# EAGLE schematic CFT-PB1-revB (EAGLE 5.11)
DRAWN_BY: Alexios; PROJECT_NAME: CFT Mini-Computer; REVISION: Rev K; SHEET_DESCRIPTION: Bus Connectors; SIMULATION_FILENAME: N/A; URL: http://www.bedroomlan.org/cft

## Sheet 1 of 11
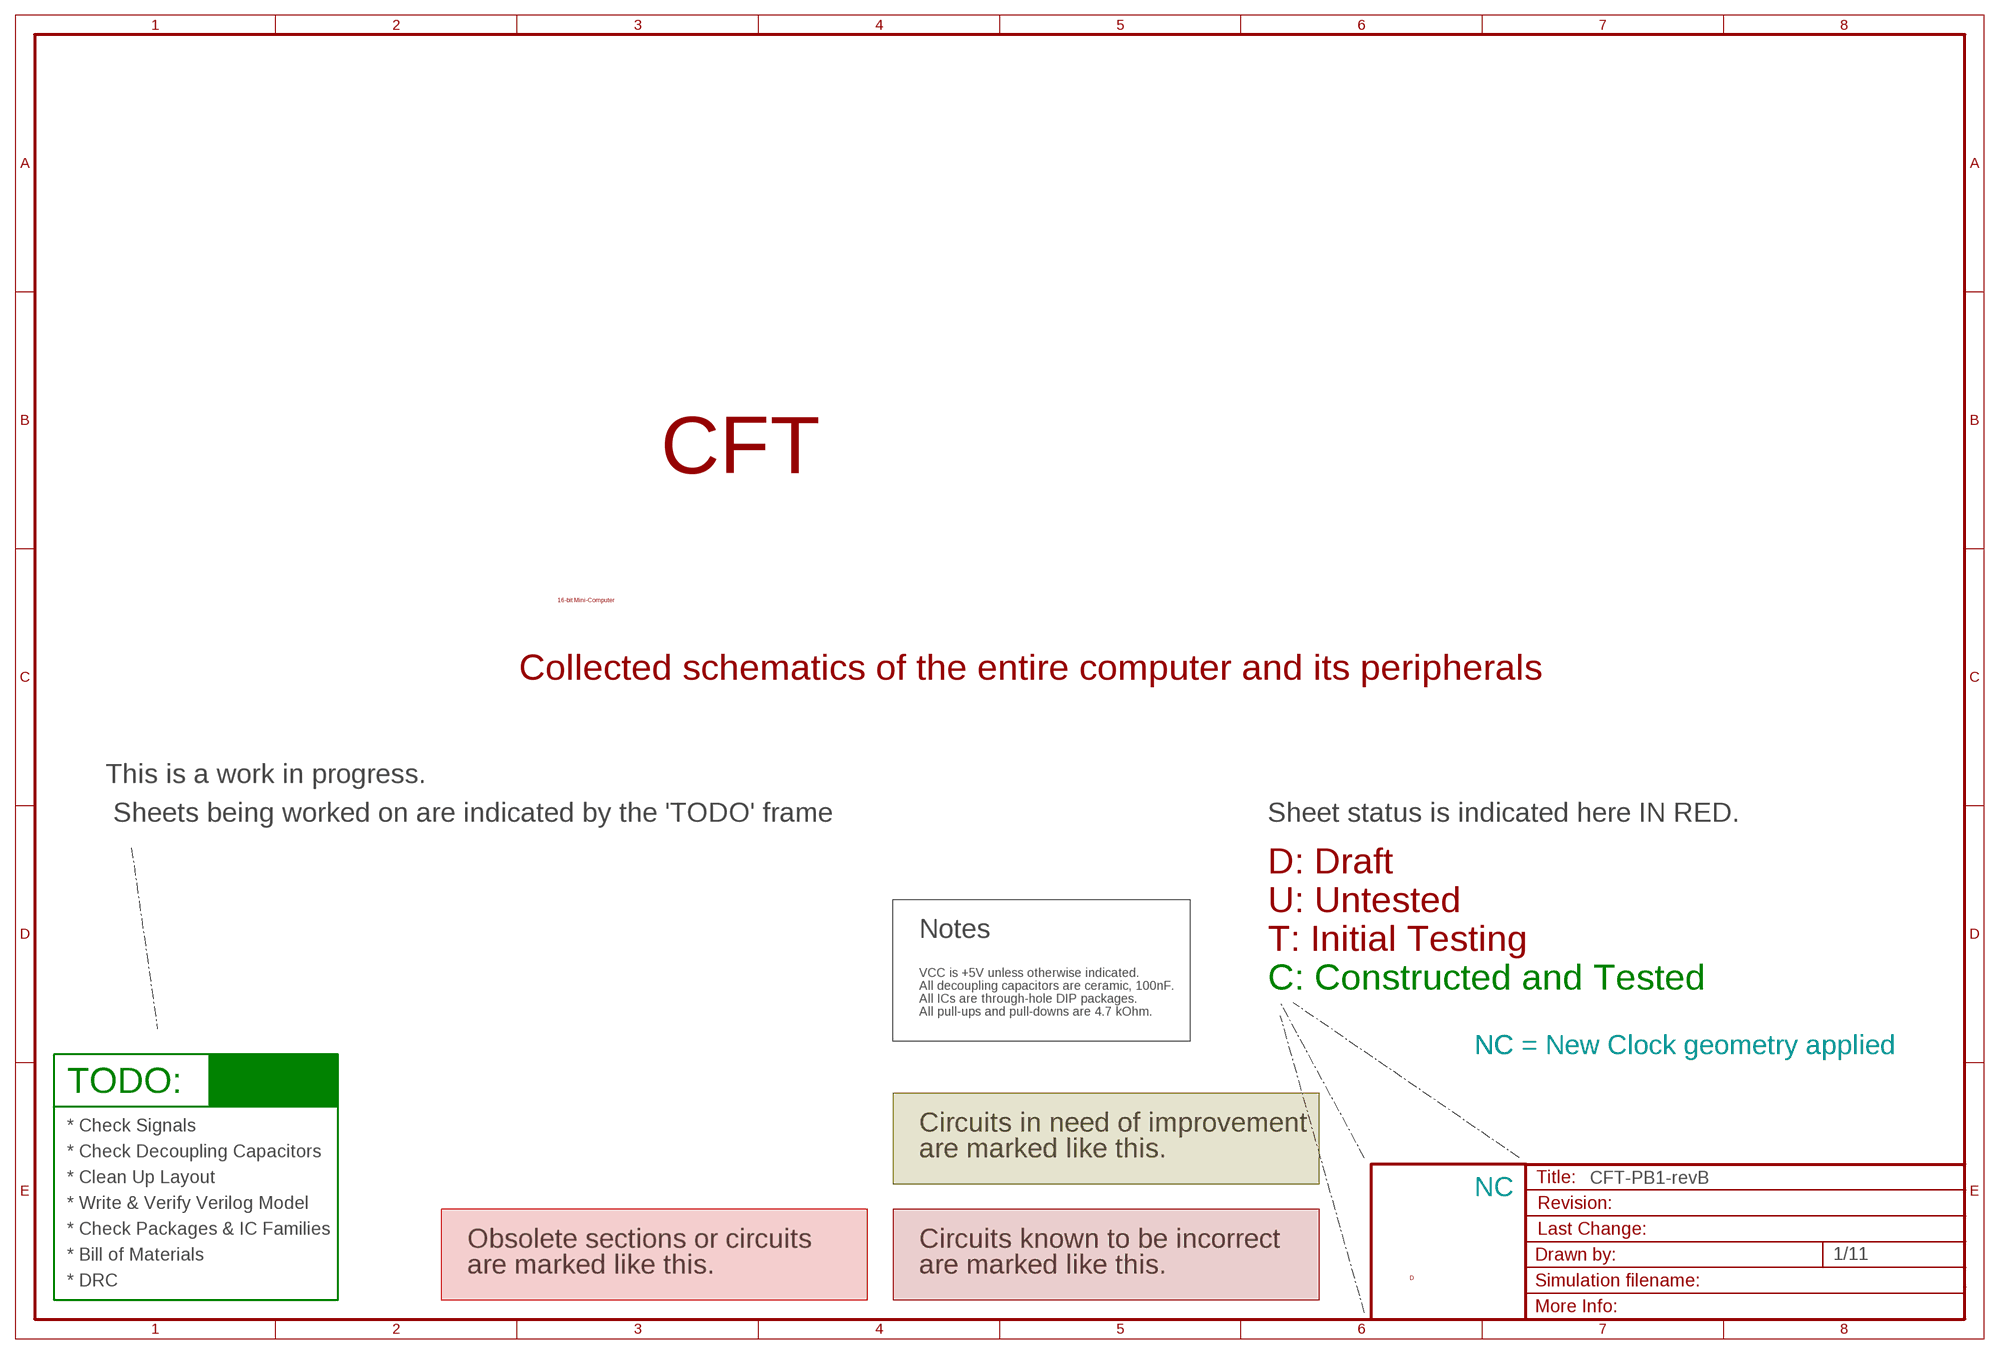
[diagram p0: schematic, sheet 1]

### Notes on the sheet
- CFT
- 16-bit Mini-Computer
- Collected schematics of the entire computer and its peripherals
- This is a work in progress.
- Sheets being worked on are indicated by the 'TODO' frame | Sheet status is indicated here IN RED.
- D: Draft
- U: Untested
- Notes
- T: Initial Testing
- VCC is +5V unless otherwise indicated.
- All decoupling capacitors are ceramic, 100nF. | C: Constructed and Tested
- All ICs are through-hole DIP packages.
- All pull-ups and pull-downs are 4.7 kOhm.
- NC | NC = New Clock geometry applied
- TODO:
- * Check Signals | Circuits in need of improvement
- * Check Decoupling Capacitors | are marked like this.
- * Clean Up Layout
- NC
- * Write & Verify Verilog Model
- * Check Packages & IC Families
- Obsolete sections or circuits | Circuits known to be incorrect
- * Bill of Materials
- are marked like this. | are marked like this.
- D
- * DRC

## Sheet 2 of 11
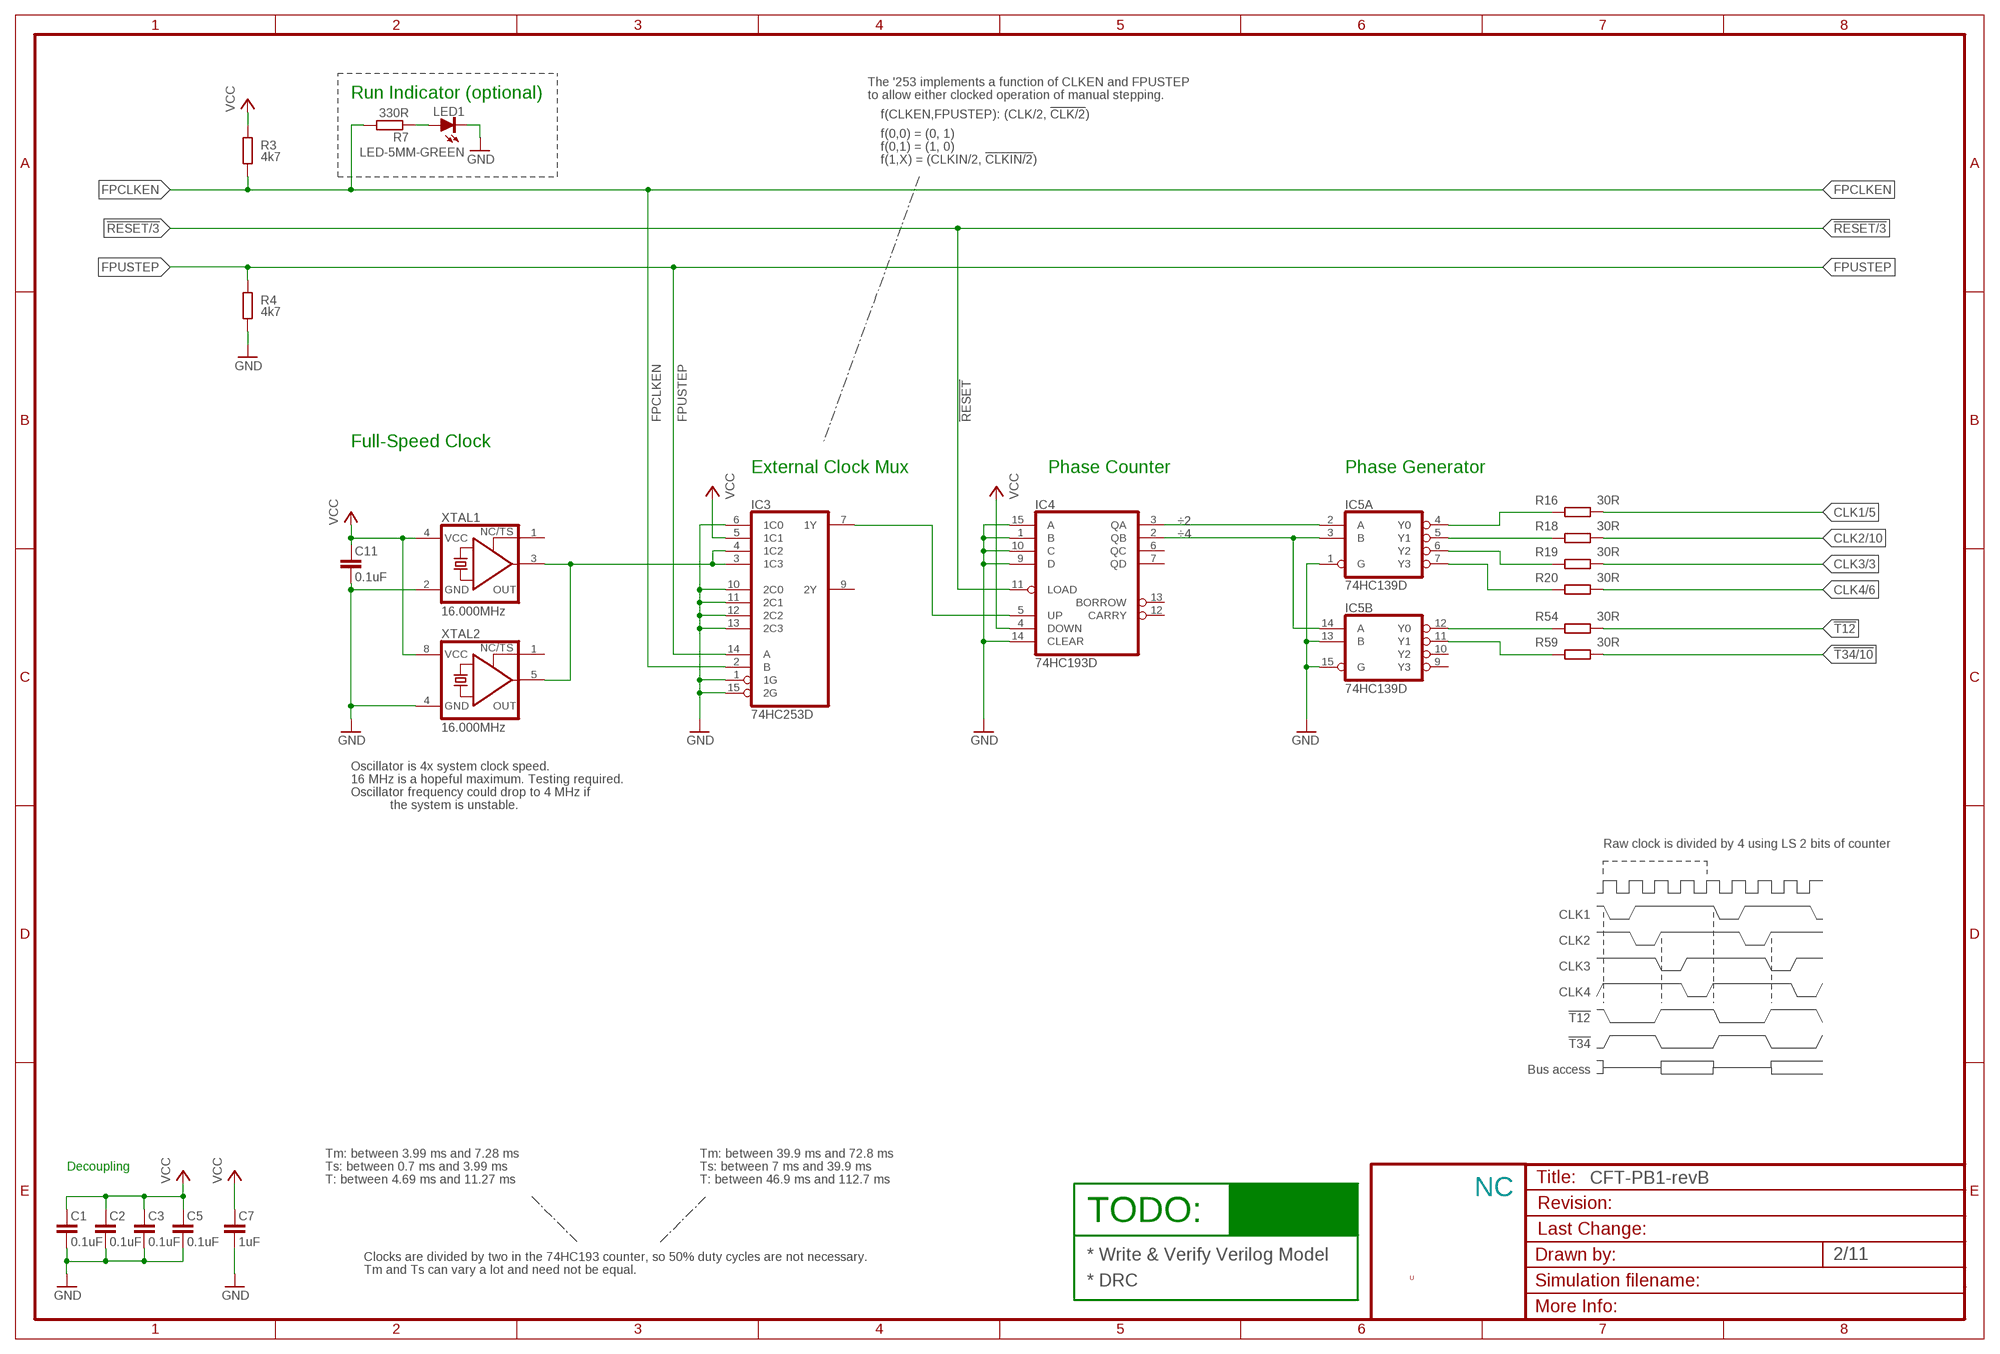
[diagram p1: schematic, sheet 2]

### Parts
C1  0.1uF  C-EUC0805K  [C0805K]
C2  0.1uF  C-EUC0805K  [C0805K]
C3  0.1uF  C-EUC0805K  [C0805K]
C5  0.1uF  C-EUC0805K  [C0805K]
C7  1uF  C-EUC1206K  [C1206K]
C11  0.1uF  C-EUC0805K  [C0805K]
IC3  74HC253D  [SO16]
IC4  74HC193D  [SO16D]
IC5  74HC139D  [SO16]
LED1  LED-5MM-GREEN  LEDCHIPLED_0805  [CHIPLED_0805]
R3  4k7  R-EU_R0805  [R0805]
R4  4k7  R-EU_R0805  [R0805]
R7  330R  R-EU_R0805  [R0805]
R16  30R  R-EU_R0805  [R0805]
R18  30R  R-EU_R0805  [R0805]
R19  30R  R-EU_R0805  [R0805]
R20  30R  R-EU_R0805  [R0805]
R54  30R  R-EU_R0805  [R0805]
R59  30R  R-EU_R0805  [R0805]
XTAL1  16.000MHz  XO-SMD-5X3.2  [CRYSTAL-SMD-5X3.2MM]
XTAL2  16.000MHz  XO-08-SOCKET  [DIL08S-SOCKET]

### Nets
!RESET: IC4.11(LOAD) ; also sheet 3,5,6,8,9,10,11
!T12: R54.1
!T34: R59.1 ; also sheet 10,11
CLK1: R16.1 ; also sheet 5,11
CLK2: R18.1 ; also sheet 10,11
CLK3: R19.1 ; also sheet 3,5,11
CLK4: R20.1 ; also sheet 6,10,11
FASTCLK: IC3.3(1C3) IC3.4(1C2) XTAL1.3(OUT) XTAL2.5(OUT)
FPCLKEN: IC3.2(B) R3.1 R7.2 ; also sheet 11
FPUSTEP: IC3.14(A) R4.2 ; also sheet 11
GND [low power]: C1.1 C2.1 C3.1 C5.1 C7.1 C11.1 IC3.1(1G) IC3.6(1C0) IC3.10(2C0) IC3.11(2C1) IC3.12(2C2) IC3.13(2C3) IC3.15(2G) IC4.1(B) IC4.9(D) IC4.10(C) IC4.14(CLEAR) IC4.15(A) IC5.1(A:G) IC5.13(B:B) IC5.15(B:G) LED1.C R4.1 XTAL1.2(GND) XTAL2.4(GND) ; also sheet 3,4,5,6,7,8,9,10,11
N$3: IC5.4(A:Y0) R16.2
N$4: IC5.5(A:Y1) R18.2
N$6: IC5.6(A:Y2) R19.2
N$7: IC5.7(A:Y3) R20.2
N$8: IC5.12(B:Y0) R54.2
N$9: IC5.11(B:Y1) R59.2
N$347: LED1.A R7.1
N$418: IC3.7(1Y) IC4.5(UP)
VCC [low power]: C1.2 C2.2 C3.2 C5.2 C7.2 C11.2 IC3.5(1C1) IC4.4(DOWN) R3.2 XTAL1.4(VCC) XTAL2.8(VCC) ; also sheet 3,4,5,6,7,8,9,10,11
÷2: IC4.3(QA) IC5.2(A:A)
÷4: IC4.2(QB) IC5.3(A:B) IC5.14(B:A)
Unconnected: IC3.9(2Y) IC4.6(QC) IC4.7(QD) IC4.12(CARRY) IC4.13(BORROW) IC5.9(B:Y3) IC5.10(B:Y2) XTAL1.1(TS) XTAL2.1(TS)

### Notes on the sheet
- The '253 implements a function of CLKEN and FPUSTEP
- Run Indicator (optional) | to allow either clocked operation of manual stepping.
- f(CLKEN,FPUSTEP): (CLK/2, !CLK/2!)
- f(0,0) = (0, 1)
- f(0,1) = (1, 0)
- f(1,X) = (CLKIN/2, !CLKIN/2!)
- Full-Speed Clock
- External Clock Mux | Phase Counter | Phase Generator
- Oscillator is 4x system clock speed.
- 16 MHz is a hopeful maximum. Testing required.
- Oscillator frequency could drop to 4 MHz if
- the system is unstable.
- Raw clock is divided by 4 using LS 2 bits of counter
- CLK1
- CLK2
- CLK3
- CLK4
- !T12
- !T34
- Bus access
- Tm: between 3.99 ms and 7.28 ms | Tm: between 39.9 ms and 72.8 ms
- Decoupling | Ts: between 0.7 ms and 3.99 ms | Ts: between 7 ms and 39.9 ms
- T: between 4.69 ms and 11.27 ms | T: between 46.9 ms and 112.7 ms
- NC
- TODO:
- Clocks are divided by two in the 74HC193 counter, so 50% duty cycles are not necessary. | * Write & Verify Verilog Model
- Tm and Ts can vary a lot and need not be equal.
- U
- * DRC

## Sheet 3 of 11
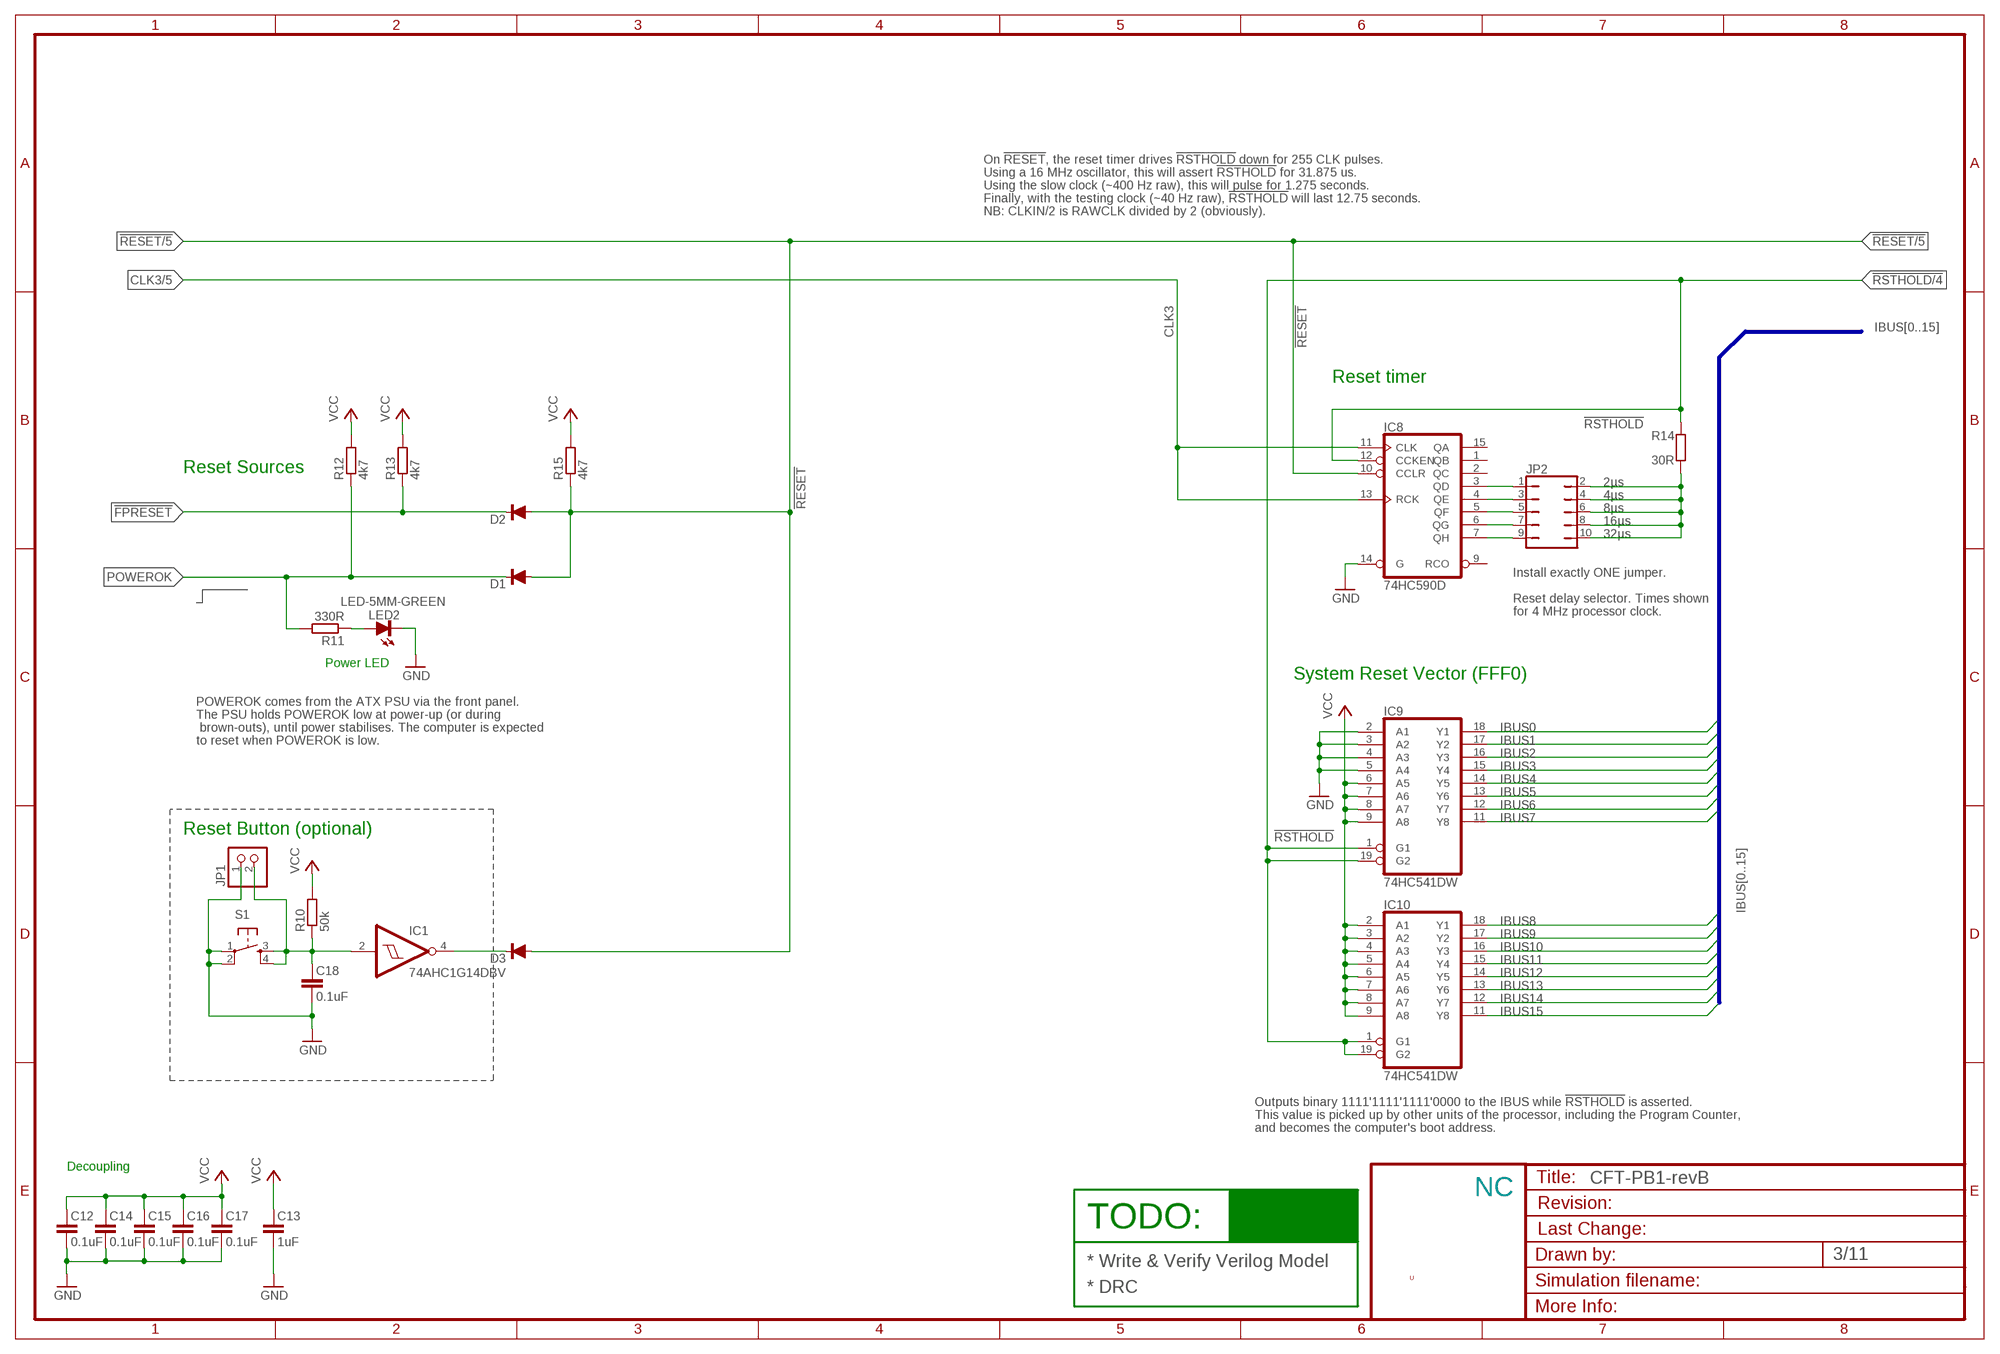
[diagram p2: schematic, sheet 3]

### Parts
C12  0.1uF  C-EUC0805K  [C0805K]
C13  1uF  C-EUC1206K  [C1206K]
C14  0.1uF  C-EUC0805K  [C0805K]
C15  0.1uF  C-EUC0805K  [C0805K]
C16  0.1uF  C-EUC0805K  [C0805K]
C17  0.1uF  C-EUC0805K  [C0805K]
C18  0.1uF  C-EUC0805K  [C0805K]
D1  DIODE-SOD123  [SOD123]
D2  DIODE-SOD123  [SOD123]
D3  DIODE-SOD123  [SOD123]
IC1  74AHC1G14DBV  [SOT23-5]
IC8  74HC590D  [SO16]
IC9  74HC541DW  [SO20W]
IC10  74HC541DW  [SO20W]
JP1  PINHD-1X2  [1X02]
JP2  JP5Q  [JP5Q]
LED2  LED-5MM-GREEN  LEDCHIPLED_0805  [CHIPLED_0805]
R10  50k  R-EU_R0805  [R0805]
R11  330R  R-EU_R0805  [R0805]
R12  4k7  R-EU_R0805  [R0805]
R13  4k7  R-EU_R0805  [R0805]
R14  30R  R-EU_R0805  [R0805]
R15  4k7  R-EU_R0805  [R0805]
S1  TAC_SWITCHPTH  [TACTILE-PTH]

### Nets
!FPRESET: D2.C R13.1 ; also sheet 11
!RESET: D1.A D2.A D3.A IC8.10(CCLR) R15.1 ; also sheet 2,5,6,8,9,10,11
!RSTHOLD: IC8.12(CCKEN) IC9.1(G1) IC9.19(G2) IC10.1(G1) IC10.19(G2) R14.1 ; also sheet 4,11
CLK3: IC8.11(CLK) IC8.13(RCK) ; also sheet 2,5,11
GND [low power]: C12.1 C13.1 C14.1 C15.1 C16.1 C17.1 C18.1 IC8.14(G) IC9.2(A1) IC9.3(A2) IC9.4(A3) IC9.5(A4) JP1.1 LED2.C S1.1 S1.2 ; also sheet 2,4,5,6,7,8,9,10,11
IBUS0: IC9.18(Y1) ; also sheet 7,8,10,11
IBUS1: IC9.17(Y2) ; also sheet 7,8,10,11
IBUS2: IC9.16(Y3) ; also sheet 7,8,10,11
IBUS3: IC9.15(Y4) ; also sheet 7,8,10,11
IBUS4: IC9.14(Y5) ; also sheet 7,8,10,11
IBUS5: IC9.13(Y6) ; also sheet 7,8,10,11
IBUS6: IC9.12(Y7) ; also sheet 7,8,10,11
IBUS7: IC9.11(Y8) ; also sheet 7,8,10,11
IBUS8: IC10.18(Y1) ; also sheet 7,8,10,11
IBUS9: IC10.17(Y2) ; also sheet 7,8,10,11
IBUS10: IC10.16(Y3) ; also sheet 7,8,10,11
IBUS11: IC10.15(Y4) ; also sheet 7,8,10,11
IBUS12: IC10.14(Y5) ; also sheet 7,8,10,11
IBUS13: IC10.13(Y6) ; also sheet 7,8,10,11
IBUS14: IC10.12(Y7) ; also sheet 7,8,10,11
IBUS15: IC10.11(Y8) ; also sheet 7,8,10,11
N$2: D3.C IC1.4(O)
N$10: JP2.2 JP2.4 JP2.6 JP2.8 JP2.10 R14.2
N$33: C18.2 IC1.2(I) JP1.2 R10.1 S1.3 S1.4
N$36: IC8.7(QH) JP2.9
N$154: IC8.6(QG) JP2.7
N$375: IC8.5(QF) JP2.5
N$376: IC8.4(QE) JP2.3
N$377: IC8.3(QD) JP2.1
POWERLED: LED2.A R11.1
POWEROK: D1.C R11.2 R12.1 ; also sheet 11
VCC [low power]: C12.2 C13.2 C14.2 C15.2 C16.2 C17.2 IC9.6(A5) IC9.7(A6) IC9.8(A7) IC9.9(A8) IC10.2(A1) IC10.3(A2) IC10.4(A3) IC10.5(A4) IC10.6(A5) IC10.7(A6) IC10.8(A7) IC10.9(A8) R10.2 R12.2 R13.2 R15.2 ; also sheet 2,4,5,6,7,8,9,10,11
Unconnected: IC8.1(QB) IC8.2(QC) IC8.9(RCO) IC8.15(QA)

### Buses
IBUS[0..15]

### Notes on the sheet
- On !RESET!, the reset timer drives !RSTHOLD! down for 255 CLK pulses.
- Using a 16 MHz oscillator, this will assert !RSTHOLD! for 31.875 us.
- Using the slow clock (~400 Hz raw), this will pulse for 1.275 seconds.
- Finally, with the testing clock (~40 Hz raw), !RSTHOLD! will last 12.75 seconds.
- NB: CLKIN/2 is RAWCLK divided by 2 (obviously).
- Reset timer
- Reset Sources
- 2µs
- 4µs
- 8µs
- 16µs
- 32µs
- Install exactly ONE jumper.
- Reset delay selector. Times shown
- for 4 MHz processor clock.
- Power LED
- System Reset Vector (FFF0)
- POWEROK comes from the ATX PSU via the front panel.
- The PSU holds POWEROK low at power-up (or during
- brown-outs), until power stabilises. The computer is expected
- to reset when POWEROK is low.
- Reset Button (optional)
- Outputs binary 1111'1111'1111'0000 to the IBUS while !RSTHOLD! is asserted.
- This value is picked up by other units of the processor, including the Program Counter,
- and becomes the computer's boot address.
- Decoupling
- NC
- TODO:
- * Write & Verify Verilog Model
- U
- * DRC

## Sheet 4 of 11
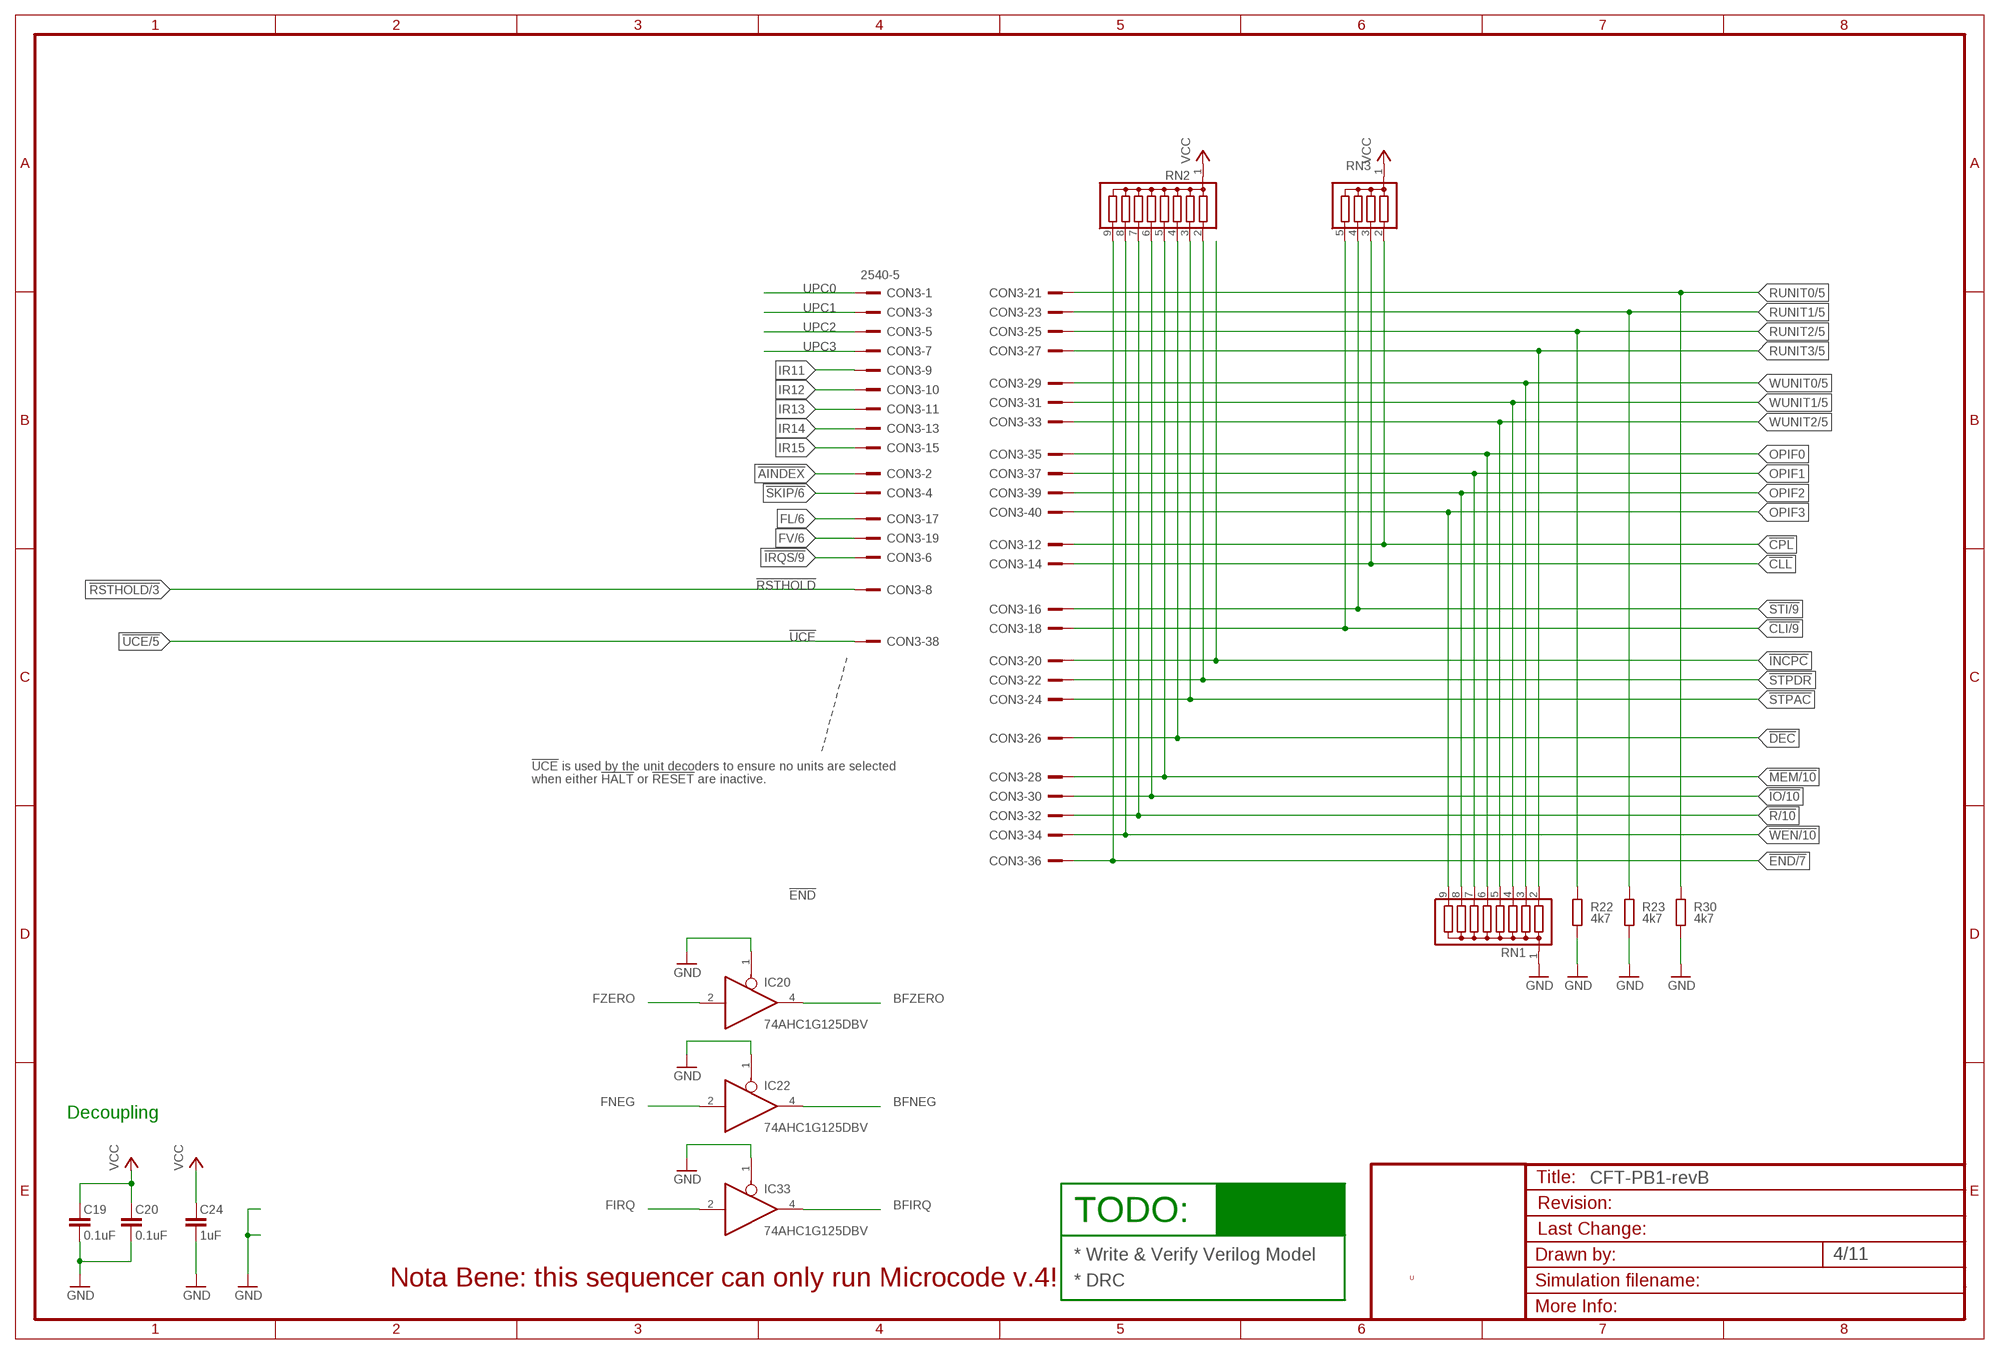
[diagram p3: schematic, sheet 4]

### Parts
C19  0.1uF  C-EUC0805K  [C0805K]
C20  0.1uF  C-EUC0805K  [C0805K]
C24  1uF  C-EUC1206K  [C1206K]
CON3  2540-5  [PAK100/2500-5-40]
IC20  74AHC1G125DBV  [SOT23-5]
IC22  74AHC1G125DBV  [SOT23-5]
IC33  74AHC1G125DBV  [SOT23-5]
R22  4k7  R-EU_R0805  [R0805]
R23  4k7  R-EU_R0805  [R0805]
R30  4k7  R-EU_R0805  [R0805]
RN1  G08R  [SIL9]
RN2  G08R  [SIL9]
RN3  G04R  [SIL5]

### Nets
!AINDEX: CON3.2
!CLI: CON3.18 RN3.5 ; also sheet 9
!CLL: CON3.14 RN3.3 ; also sheet 11
!CPL: CON3.12 RN3.2 ; also sheet 11
!DEC: CON3.26 RN2.4
!END: CON3.36 RN2.9 ; also sheet 7,9
!INCPC: CON3.20 ; also sheet 11
!IO: CON3.30 RN2.6 ; also sheet 10,11
!IRQS: CON3.6 ; also sheet 9,11
!MEM: CON3.28 RN2.5 ; also sheet 10,11
!R: CON3.32 RN2.7 ; also sheet 10,11
!RSTHOLD: CON3.8 ; also sheet 3,11
!SKIP: CON3.4 ; also sheet 6
!STI: CON3.16 RN3.4 ; also sheet 9
!STPAC: CON3.24 RN2.3 ; also sheet 11
!STPDR: CON3.22 RN2.2 ; also sheet 11
!UCE: CON3.38 ; also sheet 5
!WEN: CON3.34 RN2.8 ; also sheet 10,11
BFIRQ: IC33.4(O) ; also sheet 11
BFNEG: IC22.4(O) ; also sheet 11
BFZERO: IC20.4(O) ; also sheet 11
FIRQ: IC33.2(I) ; also sheet 9
FL: CON3.17 ; also sheet 6,11
FNEG: IC22.2(I) ; also sheet 6,11
FV: CON3.19 ; also sheet 6,11
FZERO: IC20.2(I) ; also sheet 6,11
GND [low power]: C20.1 C24.1 IC20.1(OE) IC22.1(OE) IC33.1(OE) R22.1 R23.1 R30.1 RN1.1 ; also sheet 2,3,5,6,7,8,9,10,11
IR11: CON3.9 ; also sheet 8
IR12: CON3.10 ; also sheet 8
IR13: CON3.11 ; also sheet 8
IR14: CON3.13 ; also sheet 8
IR15: CON3.15 ; also sheet 8
OPIF0: CON3.35 RN1.6 ; also sheet 6
OPIF1: CON3.37 RN1.7 ; also sheet 6
OPIF2: CON3.39 RN1.8 ; also sheet 6
OPIF3: CON3.40 RN1.9 ; also sheet 6
RUNIT0: CON3.21 R30.2 ; also sheet 5,11
RUNIT1: CON3.23 R23.2 ; also sheet 5,11
RUNIT2: CON3.25 R22.2 ; also sheet 5,11
RUNIT3: CON3.27 RN1.2 ; also sheet 5,11
UPC0: CON3.1 ; also sheet 8
UPC1: CON3.3 ; also sheet 8
UPC2: CON3.5 ; also sheet 8
UPC3: CON3.7 ; also sheet 8
VCC [low power]: C20.2 C24.2 RN2.1 RN3.1 ; also sheet 2,3,5,6,7,8,9,10,11
WUNIT0: CON3.29 RN1.3 ; also sheet 5
WUNIT1: CON3.31 RN1.4 ; also sheet 5
WUNIT2: CON3.33 RN1.5 ; also sheet 5
Unconnected: C19.1 C19.2

### Notes on the sheet
- !UCE! is used by the unit decoders to ensure no units are selected
- when either !HALT! or !RESET! are inactive.
- Decoupling
- TODO:
- * Write & Verify Verilog Model
- U
- Nota Bene: this sequencer can only run Microcode v.4! | * DRC

## Sheet 5 of 11
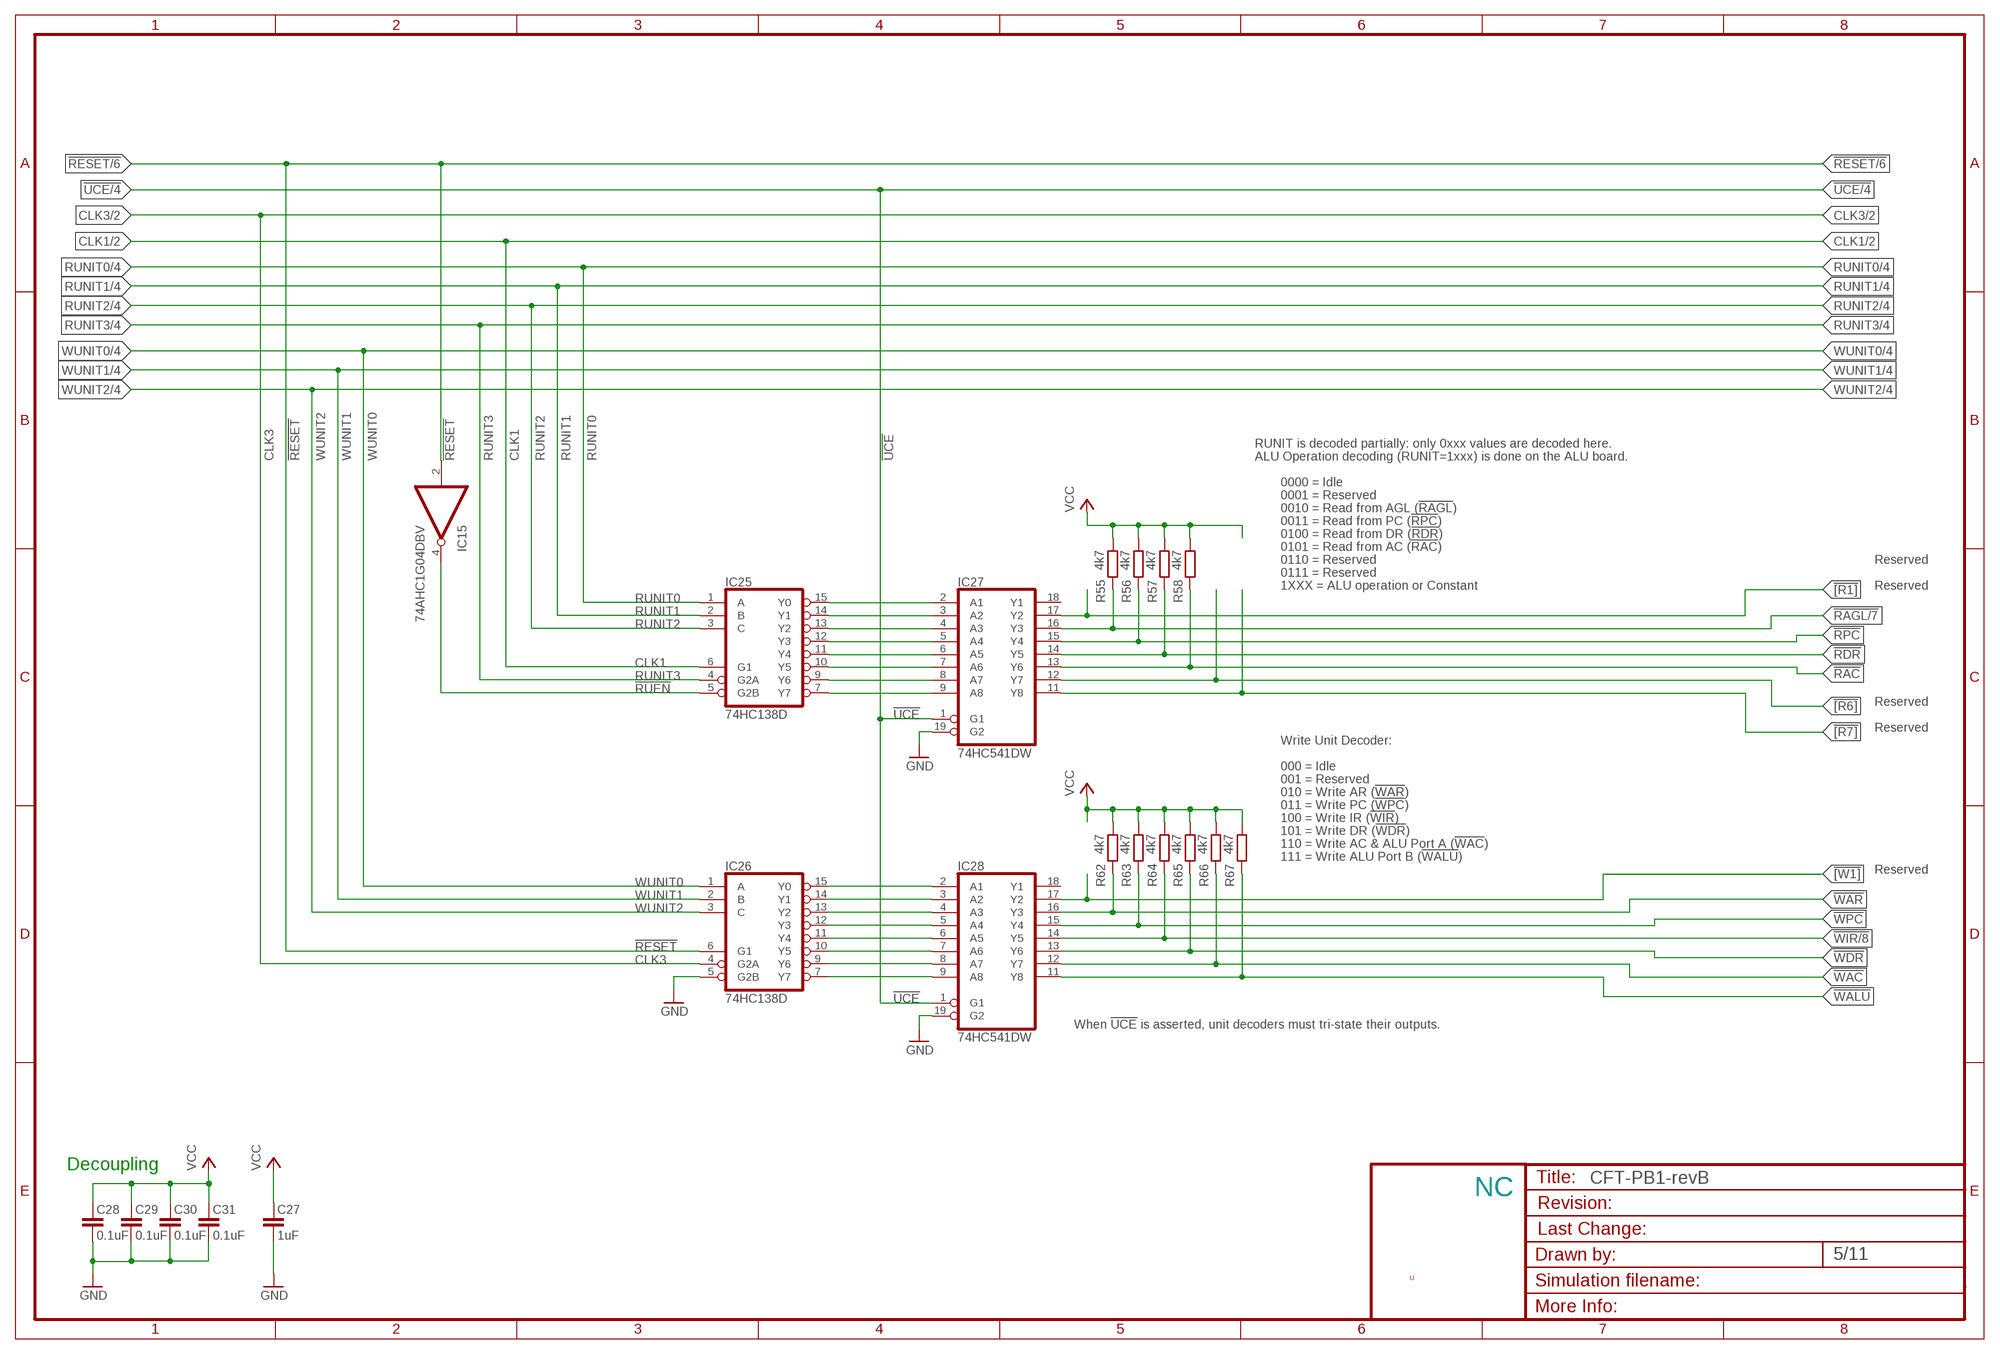
[diagram p4: schematic, sheet 5]

### Parts
C27  1uF  C-EUC1206K  [C1206K]
C28  0.1uF  C-EUC0805K  [C0805K]
C29  0.1uF  C-EUC0805K  [C0805K]
C30  0.1uF  C-EUC0805K  [C0805K]
C31  0.1uF  C-EUC0805K  [C0805K]
IC15  74AHC1G04DBV  [SOT23-5]
IC25  74HC138D  [SO16]
IC26  74HC138D  [SO16]
IC27  74HC541DW  [SO20W]
IC28  74HC541DW  [SO20W]
R55  4k7  R-EU_R0805  [R0805]
R56  4k7  R-EU_R0805  [R0805]
R57  4k7  R-EU_R0805  [R0805]
R58  4k7  R-EU_R0805  [R0805]
R62  4k7  R-EU_R0805  [R0805]
R63  4k7  R-EU_R0805  [R0805]
R64  4k7  R-EU_R0805  [R0805]
R65  4k7  R-EU_R0805  [R0805]
R66  4k7  R-EU_R0805  [R0805]
R67  4k7  R-EU_R0805  [R0805]

### Nets
![R1]: IC27.17(Y2)
![R6]: IC27.12(Y7)
![R7]: IC27.11(Y8)
![W1]: IC28.17(Y2)
!RAC: IC27.13(Y6) R58.1 ; also sheet 11
!RAGL: IC27.16(Y3) R55.1 ; also sheet 7
!RDR: IC27.14(Y5) R57.1 ; also sheet 11
!RESET: IC15.2(I) IC26.6(G1) ; also sheet 2,3,6,8,9,10,11
!RPC: IC27.15(Y4) R56.1 ; also sheet 11
!RUEN: IC15.4(O) IC25.5(G2B)
!UCE: IC27.1(G1) IC28.1(G1) ; also sheet 4
!WAC: IC28.12(Y7) R66.1 ; also sheet 11
!WALU: IC28.11(Y8) R67.1 ; also sheet 11
!WAR: IC28.16(Y3) R62.1 ; also sheet 11
!WDR: IC28.13(Y6) R65.1 ; also sheet 11
!WIR: IC28.14(Y5) R64.1 ; also sheet 8,11
!WPC: IC28.15(Y4) R63.1 ; also sheet 11
CLK1: IC25.6(G1) ; also sheet 2,11
CLK3: IC26.4(G2A) ; also sheet 2,3,11
GND [low power]: C27.1 C28.1 C29.1 C30.1 C31.1 IC26.5(G2B) IC27.19(G2) IC28.19(G2) ; also sheet 2,3,4,6,7,8,9,10,11
N$458: IC25.7(Y7) IC27.9(A8)
N$459: IC25.9(Y6) IC27.8(A7)
N$460: IC25.10(Y5) IC27.7(A6)
N$461: IC25.11(Y4) IC27.6(A5)
N$463: IC25.12(Y3) IC27.5(A4)
N$464: IC25.13(Y2) IC27.4(A3)
N$465: IC25.14(Y1) IC27.3(A2)
N$466: IC25.15(Y0) IC27.2(A1)
N$483: IC26.15(Y0) IC28.2(A1)
N$484: IC26.14(Y1) IC28.3(A2)
N$485: IC26.13(Y2) IC28.4(A3)
N$486: IC26.12(Y3) IC28.5(A4)
N$487: IC26.11(Y4) IC28.6(A5)
N$488: IC26.10(Y5) IC28.7(A6)
N$505: IC26.9(Y6) IC28.8(A7)
N$506: IC26.7(Y7) IC28.9(A8)
RUNIT0: IC25.1(A) ; also sheet 4,11
RUNIT1: IC25.2(B) ; also sheet 4,11
RUNIT2: IC25.3(C) ; also sheet 4,11
RUNIT3: IC25.4(G2A) ; also sheet 4,11
VCC [low power]: C27.2 C28.2 C29.2 C30.2 C31.2 R55.2 R56.2 R57.2 R58.2 R62.2 R63.2 R64.2 R65.2 R66.2 R67.2 ; also sheet 2,3,4,6,7,8,9,10,11
WUNIT0: IC26.1(A) ; also sheet 4
WUNIT1: IC26.2(B) ; also sheet 4
WUNIT2: IC26.3(C) ; also sheet 4
Unconnected: IC27.18(Y1) IC28.18(Y1)

### Notes on the sheet
- RUNIT is decoded partially: only 0xxx values are decoded here.
- ALU Operation decoding (RUNIT=1xxx) is done on the ALU board.
- 0000 = Idle
- 0001 = Reserved
- 0010 = Read from AGL (!RAGL!)
- 0011 = Read from PC (!RPC!)
- 0100 = Read from DR (!RDR!)
- 0101 = Read from AC (!RAC!)
- 0110 = Reserved | Reserved
- 0111 = Reserved
- 1XXX = ALU operation or Constant | Reserved
- Reserved
- Reserved
- Write Unit Decoder:
- 000 = Idle
- 001 = Reserved
- 010 = Write AR (!WAR!)
- 011 = Write PC (!WPC!)
- 100 = Write IR (!WIR!)
- 101 = Write DR (!WDR!)
- 110 = Write AC & ALU Port A (!WAC!)
- 111 = Write ALU Port B (!WALU!)
- Reserved
- When !UCE! is asserted, unit decoders must tri-state their outputs.
- Decoupling
- NC
- U

## Sheet 6 of 11
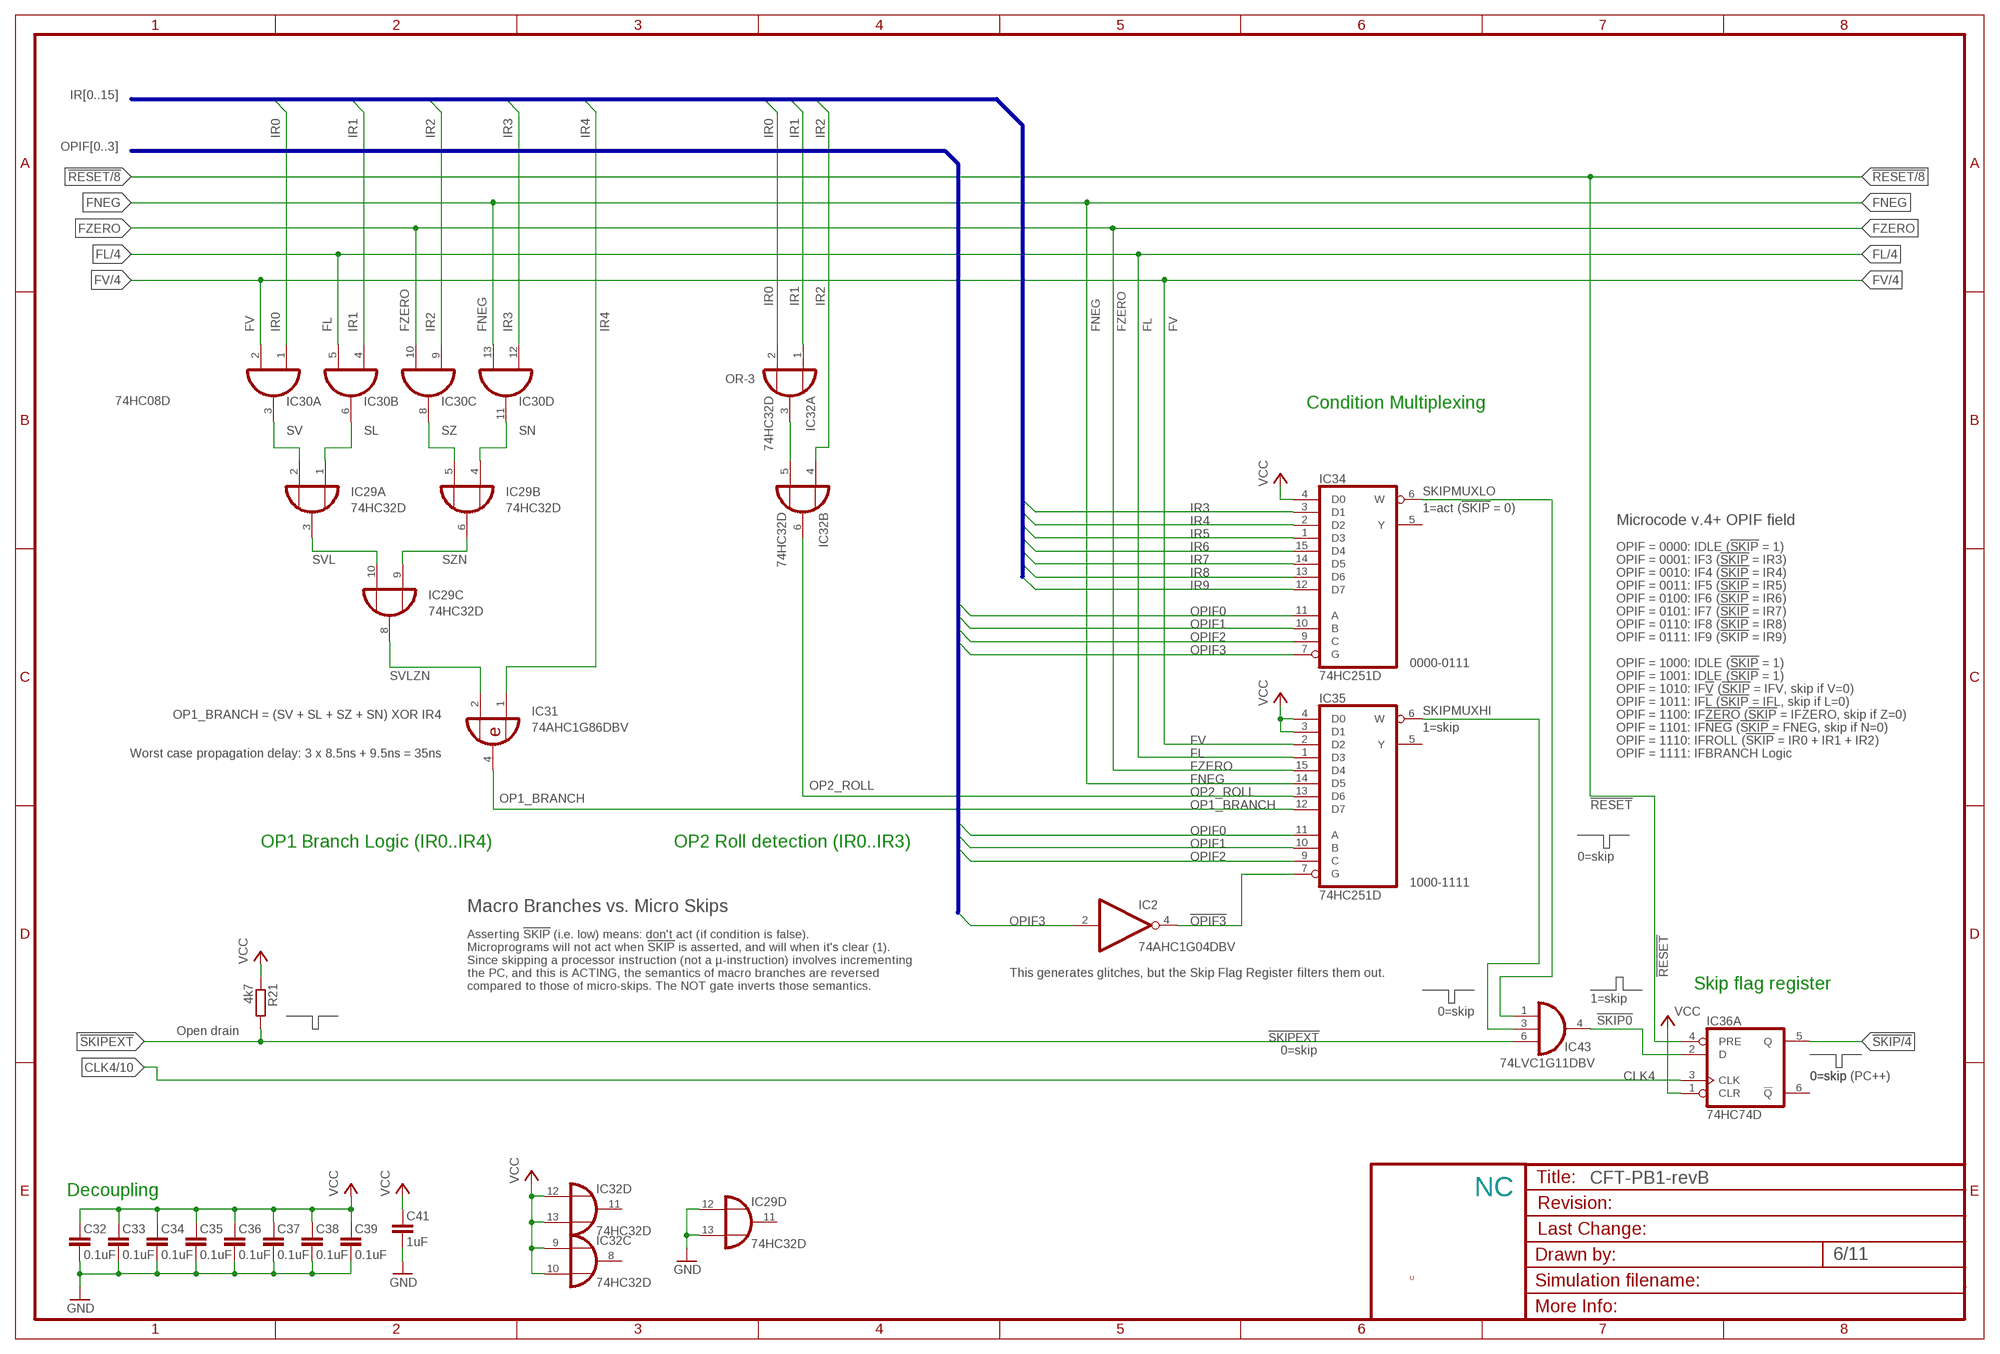
[diagram p5: schematic, sheet 6]

### Parts
C32  0.1uF  C-EUC0805K  [C0805K]
C33  0.1uF  C-EUC0805K  [C0805K]
C34  0.1uF  C-EUC0805K  [C0805K]
C35  0.1uF  C-EUC0805K  [C0805K]
C36  0.1uF  C-EUC0805K  [C0805K]
C37  0.1uF  C-EUC0805K  [C0805K]
C38  0.1uF  C-EUC0805K  [C0805K]
C39  0.1uF  C-EUC0805K  [C0805K]
C41  1uF  C-EUC1206K  [C1206K]
IC2  74AHC1G04DBV  [SOT23-5]
IC29  74HC32D  [SO14]
IC30  74HC08D  [SO14]
IC31  74AHC1G86DBV  [SOT23-5]
IC32  74HC32D  [SO14]
IC34  74HC251D  [SO16]
IC35  74HC251D  [SO16]
IC36  74HC74D  [SO14]
IC43  74LVC1G11DBV  [DBV_R-PDSO-G6]
R21  4k7  R-EU_R0805  [R0805]

### Nets
!OPIF3: IC2.4(O) IC35.7(G)
!RESET: IC36.4(A:PRE) ; also sheet 2,3,5,8,9,10,11
!SKIP: IC36.5(A:Q) ; also sheet 4
!SKIP0: IC36.2(A:D) IC43.4(O)
!SKIPEXT: IC43.6(I2) R21.2 ; also sheet 11
CLK4: IC36.3(A:CLK) ; also sheet 2,10,11
FL: IC30.5(B:I1) IC35.1(D3) ; also sheet 4,11
FNEG: IC30.13(D:I1) IC35.14(D5) ; also sheet 4,11
FV: IC30.2(A:I1) IC35.2(D2) ; also sheet 4,11
FZERO: IC30.10(C:I1) IC35.15(D4) ; also sheet 4,11
GND [low power]: C32.1 C33.1 C34.1 C35.1 C36.1 C37.1 C38.1 C39.1 C41.1 IC29.12(D:I0) IC29.13(D:I1) ; also sheet 2,3,4,5,7,8,9,10,11
IR0: IC30.1(A:I0) IC32.2(A:I1) ; also sheet 7,8,11
IR1: IC30.4(B:I0) IC32.1(A:I0) ; also sheet 7,8,11
IR2: IC30.9(C:I0) IC32.4(B:I0) ; also sheet 7,8,11
IR3: IC30.12(D:I0) IC34.3(D1) ; also sheet 7,8,11
IR4: IC31.1(I0) IC34.2(D2) ; also sheet 7,8
IR5: IC34.1(D3) ; also sheet 7,8
IR6: IC34.15(D4) ; also sheet 7,8
IR7: IC34.14(D5) ; also sheet 7,8
IR8: IC34.13(D6) ; also sheet 7,8
IR9: IC34.12(D7) ; also sheet 7,8
N$23: IC32.3(A:O) IC32.5(B:I1)
OP1_BRANCH: IC31.4(O) IC35.12(D7)
OP2_ROLL: IC32.6(B:O) IC35.13(D6)
OPIF0: IC34.11(A) IC35.11(A) ; also sheet 4
OPIF1: IC34.10(B) IC35.10(B) ; also sheet 4
OPIF2: IC34.9(C) IC35.9(C) ; also sheet 4
OPIF3: IC2.2(I) IC34.7(G) ; also sheet 4
SKIPMUXHI: IC35.6(W) IC43.3(I1)
SKIPMUXLO: IC34.6(W) IC43.1(I0)
SL: IC29.1(A:I0) IC30.6(B:O)
SN: IC29.4(B:I0) IC30.11(D:O)
SV: IC29.2(A:I1) IC30.3(A:O)
SVL: IC29.3(A:O) IC29.10(C:I1)
SVLZN: IC29.8(C:O) IC31.2(I1)
SZ: IC29.5(B:I1) IC30.8(C:O)
SZN: IC29.6(B:O) IC29.9(C:I0)
VCC [low power]: C32.2 C33.2 C34.2 C35.2 C36.2 C37.2 C38.2 C39.2 C41.2 IC32.9(C:I0) IC32.10(C:I1) IC32.12(D:I0) IC32.13(D:I1) IC34.4(D0) IC35.3(D1) IC35.4(D0) IC36.1(A:CLR) R21.1 ; also sheet 2,3,4,5,7,8,9,10,11
Unconnected: IC29.11(D:O) IC32.8(C:O) IC32.11(D:O) IC34.5(Y) IC35.5(Y) IC36.6(A:!Q)

### Buses
IR[0..15]
OPIF[0..3]

### Notes on the sheet
- OR-3
- Condition Multiplexing
- 1=act (!SKIP! = 0)
- Microcode v.4+ OPIF field
- OPIF = 0000: IDLE (!SKIP! = 1)
- OPIF = 0001: IF3 (!SKIP! = IR3)
- OPIF = 0010: IF4 (!SKIP! = IR4)
- OPIF = 0011: IF5 (!SKIP! = IR5)
- OPIF = 0100: IF6 (!SKIP! = IR6)
- OPIF = 0101: IF7 (!SKIP! = IR7)
- OPIF = 0110: IF8 (!SKIP! = IR8)
- OPIF = 0111: IF9 (!SKIP! = IR9)
- 0000-0111 | OPIF = 1000: IDLE (!SKIP! = 1)
- OPIF = 1001: IDLE (!SKIP! = 1)
- OPIF = 1010: IF!V! (!SKIP! = IFV, skip if V=0)
- OPIF = 1011: IF!L! (!SKIP! = IFL, skip if L=0)
- OP1_BRANCH = (SV + SL + SZ + SN) XOR IR4 | OPIF = 1100: IF!ZERO! (!SKIP! = IFZERO, skip if Z=0)
- 1=skip | OPIF = 1101: IF!NEG! (!SKIP! = FNEG, skip if N=0)
- OPIF = 1110: IFROLL (!SKIP! = IR0 + IR1 + IR2)
- Worst case propagation delay: 3 x 8.5ns + 9.5ns = 35ns | OPIF = 1111: IFBRANCH Logic
- OP1 Branch Logic (IR0..IR4) | OP2 Roll detection (IR0..IR3)
- 0=skip
- 1000-1111
- Macro Branches vs. Micro Skips
- Asserting !SKIP! (i.e. low) means: don't act (if condition is false).
- Microprograms will not act when !SKIP! is asserted, and will when it's clear (1).
- Since skipping a processor instruction (not a µ-instruction) involves incrementing
- the PC, and this is ACTING, the semantics of macro branches are reversed | This generates glitches, but the Skip Flag Register filters them out.
- compared to those of micro-skips. The NOT gate inverts those semantics. | Skip flag register
- 1=skip
- 0=skip
- Open drain
- 0=skip
- 0=skip | 0=skip (PC++)
- Decoupling | NC
- U

## Sheet 7 of 11
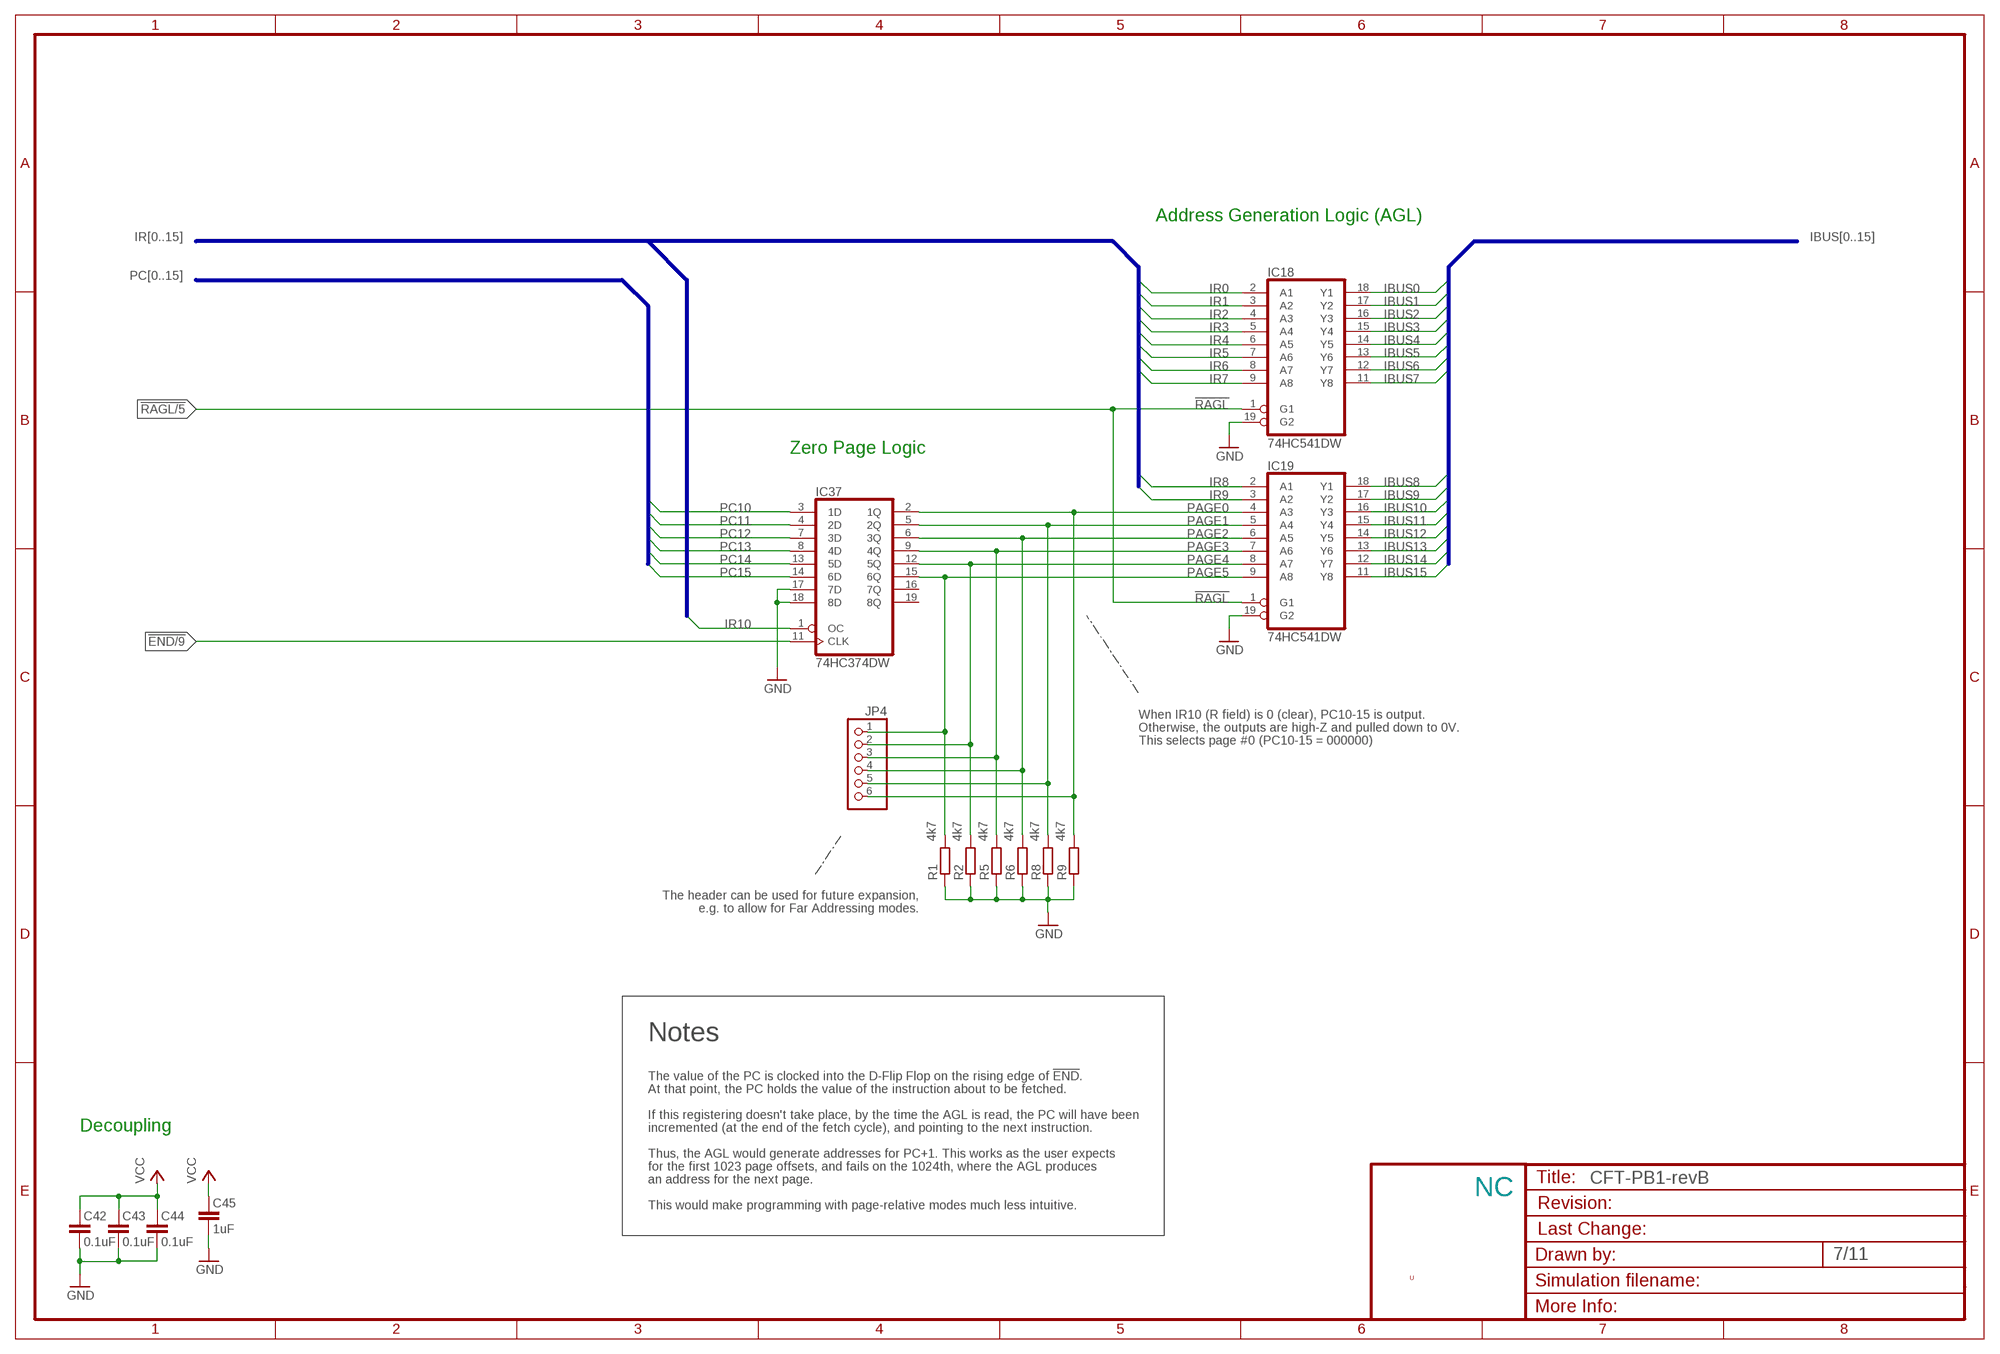
[diagram p6: schematic, sheet 7]

### Parts
C42  0.1uF  C-EUC0805K  [C0805K]
C43  0.1uF  C-EUC0805K  [C0805K]
C44  0.1uF  C-EUC0805K  [C0805K]
C45  1uF  C-EUC1206K  [C1206K]
IC18  74HC541DW  [SO20W]
IC19  74HC541DW  [SO20W]
IC37  74HC374DW  [SO20W]
JP4  PINHD-1X6/90  [1X06/90]
R1  4k7  R-EU_R0805  [R0805]
R2  4k7  R-EU_R0805  [R0805]
R5  4k7  R-EU_R0805  [R0805]
R6  4k7  R-EU_R0805  [R0805]
R8  4k7  R-EU_R0805  [R0805]
R9  4k7  R-EU_R0805  [R0805]

### Nets
!END: IC37.11(CLK) ; also sheet 4,9
!RAGL: IC18.1(G1) IC19.1(G1) ; also sheet 5
GND [low power]: C42.1 C43.1 C44.1 C45.1 IC18.19(G2) IC19.19(G2) IC37.17(7D) IC37.18(8D) R1.1 R2.1 R5.1 R6.1 R8.1 R9.1 ; also sheet 2,3,4,5,6,8,9,10,11
IBUS0: IC18.18(Y1) ; also sheet 3,8,10,11
IBUS1: IC18.17(Y2) ; also sheet 3,8,10,11
IBUS2: IC18.16(Y3) ; also sheet 3,8,10,11
IBUS3: IC18.15(Y4) ; also sheet 3,8,10,11
IBUS4: IC18.14(Y5) ; also sheet 3,8,10,11
IBUS5: IC18.13(Y6) ; also sheet 3,8,10,11
IBUS6: IC18.12(Y7) ; also sheet 3,8,10,11
IBUS7: IC18.11(Y8) ; also sheet 3,8,10,11
IBUS8: IC19.18(Y1) ; also sheet 3,8,10,11
IBUS9: IC19.17(Y2) ; also sheet 3,8,10,11
IBUS10: IC19.16(Y3) ; also sheet 3,8,10,11
IBUS11: IC19.15(Y4) ; also sheet 3,8,10,11
IBUS12: IC19.14(Y5) ; also sheet 3,8,10,11
IBUS13: IC19.13(Y6) ; also sheet 3,8,10,11
IBUS14: IC19.12(Y7) ; also sheet 3,8,10,11
IBUS15: IC19.11(Y8) ; also sheet 3,8,10,11
IR0: IC18.2(A1) ; also sheet 6,8,11
IR1: IC18.3(A2) ; also sheet 6,8,11
IR2: IC18.4(A3) ; also sheet 6,8,11
IR3: IC18.5(A4) ; also sheet 6,8,11
IR4: IC18.6(A5) ; also sheet 6,8
IR5: IC18.7(A6) ; also sheet 6,8
IR6: IC18.8(A7) ; also sheet 6,8
IR7: IC18.9(A8) ; also sheet 6,8
IR8: IC19.2(A1) ; also sheet 6,8
IR9: IC19.3(A2) ; also sheet 6,8
IR10: IC37.1(OC) ; also sheet 8
PAGE0: IC19.4(A3) IC37.2(1Q) JP4.6 R9.2
PAGE1: IC19.5(A4) IC37.5(2Q) JP4.5 R8.2
PAGE2: IC19.6(A5) IC37.6(3Q) JP4.4 R6.2
PAGE3: IC19.7(A6) IC37.9(4Q) JP4.3 R5.2
PAGE4: IC19.8(A7) IC37.12(5Q) JP4.2 R2.2
PAGE5: IC19.9(A8) IC37.15(6Q) JP4.1 R1.2
PC10: IC37.3(1D) ; also sheet 11
PC11: IC37.4(2D) ; also sheet 11
PC12: IC37.7(3D) ; also sheet 11
PC13: IC37.8(4D) ; also sheet 11
PC14: IC37.13(5D) ; also sheet 11
PC15: IC37.14(6D) ; also sheet 11
VCC [low power]: C42.2 C43.2 C44.2 C45.2 ; also sheet 2,3,4,5,6,8,9,10,11
Unconnected: IC37.16(7Q) IC37.19(8Q)

### Buses
IBUS[0..15]
IR[0..15]
PC[0..15]

### Notes on the sheet
- Address Generation Logic (AGL)
- Zero Page Logic
- When IR10 (R field) is 0 (clear), PC10-15 is output.
- Otherwise, the outputs are high-Z and pulled down to 0V.
- This selects page #0 (PC10-15 = 000000)
- The header can be used for future expansion,
- e.g. to allow for Far Addressing modes.
- Notes
- The value of the PC is clocked into the D-Flip Flop on the rising edge of !END!.
- At that point, the PC holds the value of the instruction about to be fetched.
- If this registering doesn't take place, by the time the AGL is read, the PC will have been
- Decoupling | incremented (at the end of the fetch cycle), and pointing to the next instruction.
- Thus, the AGL would generate addresses for PC+1. This works as the user expects
- for the first 1023 page offsets, and fails on the 1024th, where the AGL produces
- an address for the next page.
- NC
- This would make programming with page-relative modes much less intuitive.
- U

## Sheet 8 of 11
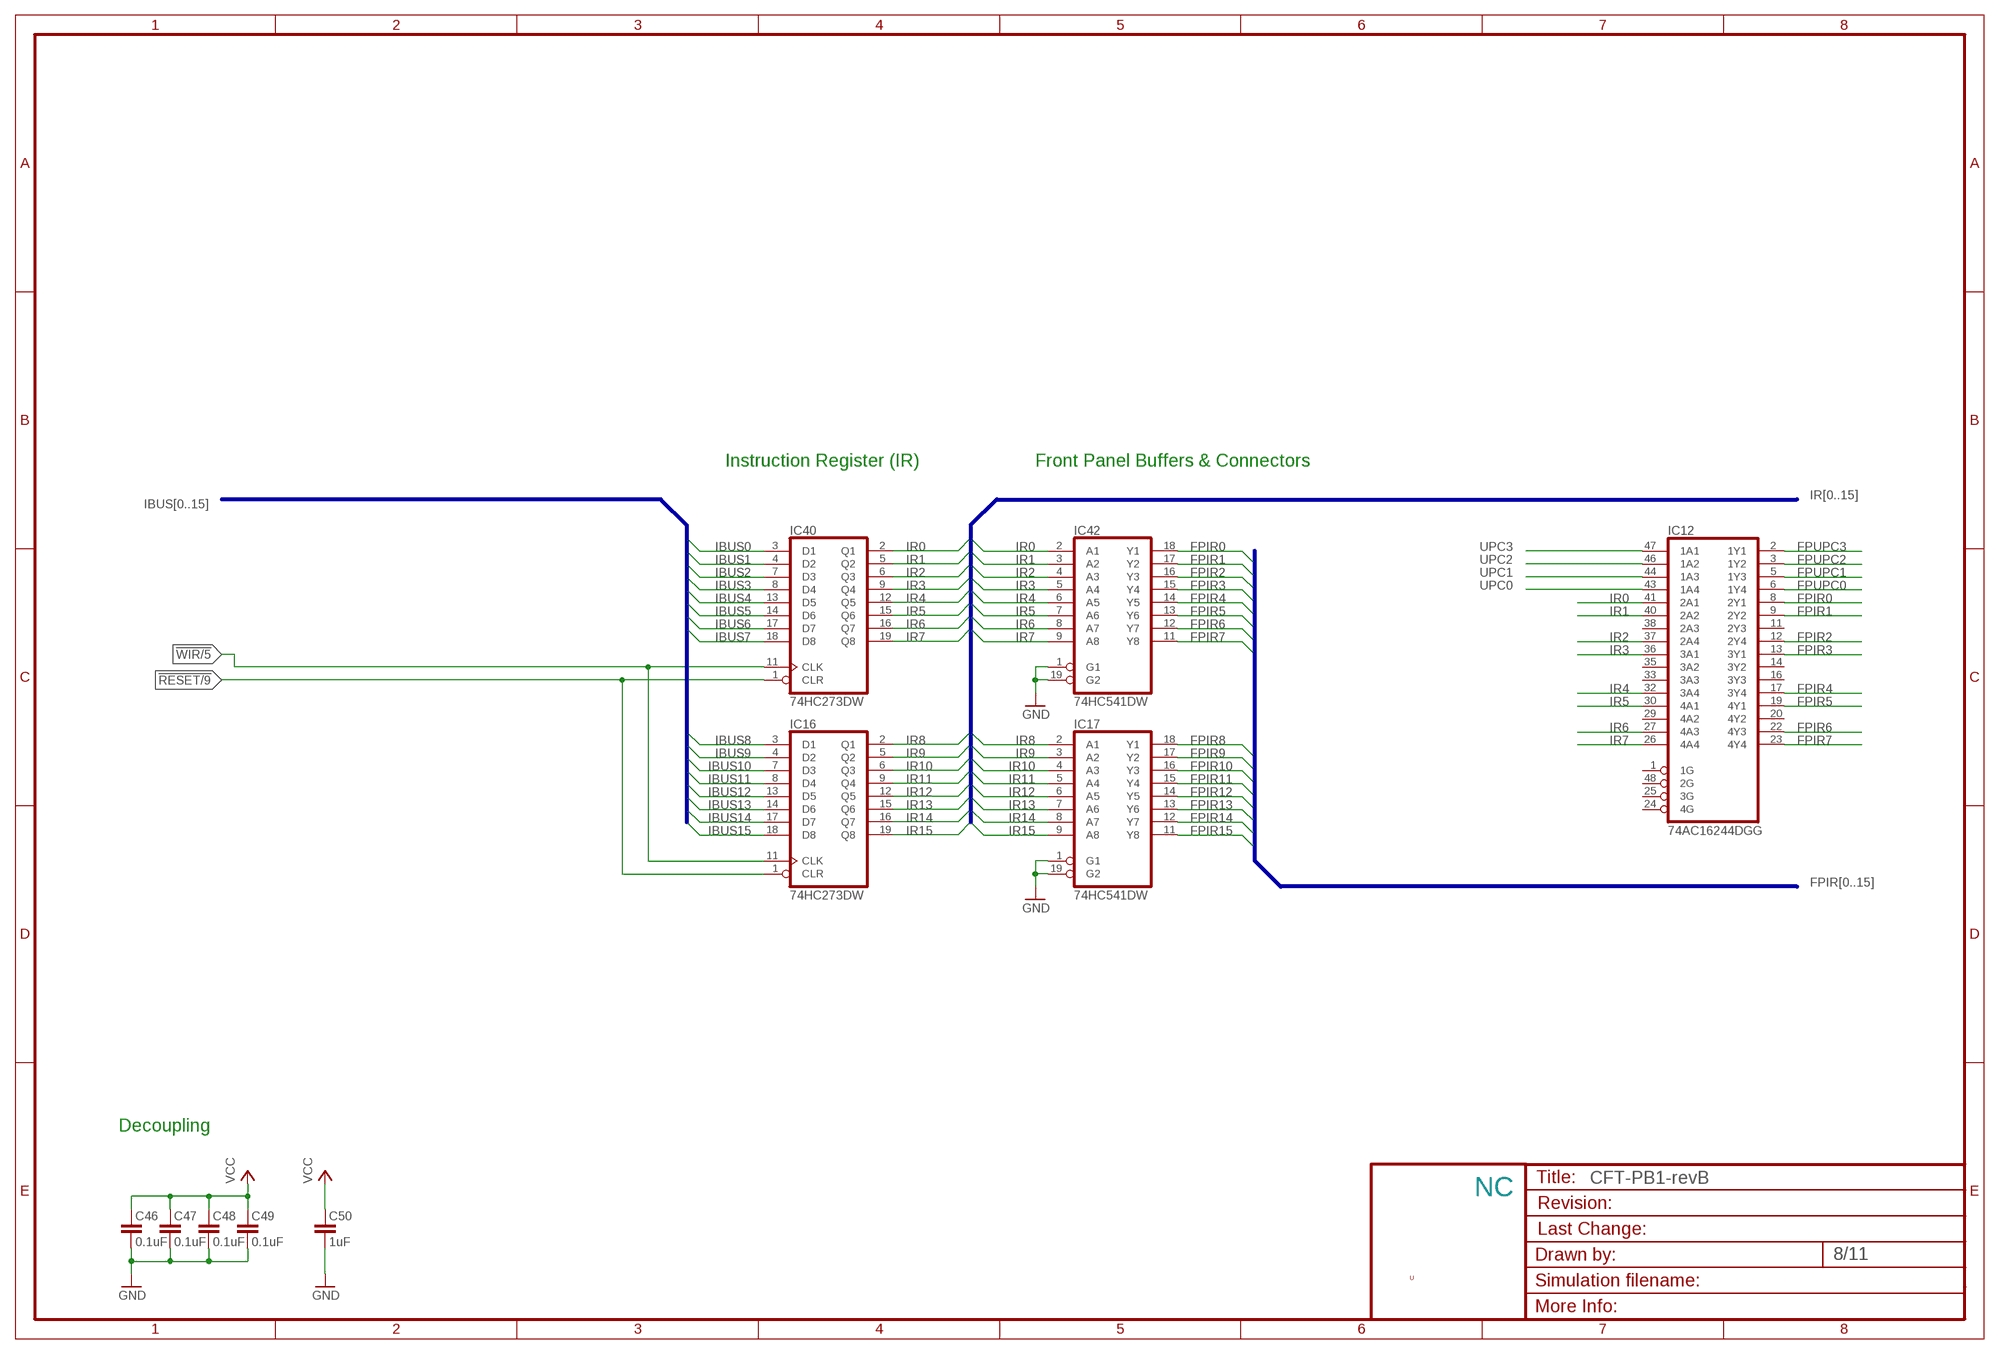
[diagram p7: schematic, sheet 8]

### Parts
C46  0.1uF  C-EUC0805K  [C0805K]
C47  0.1uF  C-EUC0805K  [C0805K]
C48  0.1uF  C-EUC0805K  [C0805K]
C49  0.1uF  C-EUC0805K  [C0805K]
C50  1uF  C-EUC1206K  [C1206K]
IC12  74AC16244DGG  [TSSOP-48]
IC16  74HC273DW  [SO20W]
IC17  74HC541DW  [SO20W]
IC40  74HC273DW  [SO20W]
IC42  74HC541DW  [SO20W]

### Nets
!RESET: IC16.1(CLR) IC40.1(CLR) ; also sheet 2,3,5,6,9,10,11
!WIR: IC16.11(CLK) IC40.11(CLK) ; also sheet 5,11
FPIR0: IC12.8(2Y1) IC42.18(Y1) ; also sheet 11
FPIR1: IC12.9(2Y2) IC42.17(Y2) ; also sheet 11
FPIR2: IC12.12(2Y4) IC42.16(Y3) ; also sheet 11
FPIR3: IC12.13(3Y1) IC42.15(Y4) ; also sheet 11
FPIR4: IC12.17(3Y4) IC42.14(Y5) ; also sheet 11
FPIR5: IC12.19(4Y1) IC42.13(Y6) ; also sheet 11
FPIR6: IC12.22(4Y3) IC42.12(Y7) ; also sheet 11
FPIR7: IC12.23(4Y4) IC42.11(Y8) ; also sheet 11
FPIR8: IC17.18(Y1) ; also sheet 11
FPIR9: IC17.17(Y2) ; also sheet 11
FPIR10: IC17.16(Y3) ; also sheet 11
FPIR11: IC17.15(Y4) ; also sheet 11
FPIR12: IC17.14(Y5) ; also sheet 11
FPIR13: IC17.13(Y6) ; also sheet 11
FPIR14: IC17.12(Y7) ; also sheet 11
FPIR15: IC17.11(Y8) ; also sheet 11
FPUPC0: IC12.6(1Y4) ; also sheet 11
FPUPC1: IC12.5(1Y3) ; also sheet 11
FPUPC2: IC12.3(1Y2) ; also sheet 11
FPUPC3: IC12.2(1Y1) ; also sheet 11
GND [low power]: C46.1 C47.1 C48.1 C49.1 C50.1 IC17.1(G1) IC17.19(G2) IC42.1(G1) IC42.19(G2) ; also sheet 2,3,4,5,6,7,9,10,11
IBUS0: IC40.3(D1) ; also sheet 3,7,10,11
IBUS1: IC40.4(D2) ; also sheet 3,7,10,11
IBUS2: IC40.7(D3) ; also sheet 3,7,10,11
IBUS3: IC40.8(D4) ; also sheet 3,7,10,11
IBUS4: IC40.13(D5) ; also sheet 3,7,10,11
IBUS5: IC40.14(D6) ; also sheet 3,7,10,11
IBUS6: IC40.17(D7) ; also sheet 3,7,10,11
IBUS7: IC40.18(D8) ; also sheet 3,7,10,11
IBUS8: IC16.3(D1) ; also sheet 3,7,10,11
IBUS9: IC16.4(D2) ; also sheet 3,7,10,11
IBUS10: IC16.7(D3) ; also sheet 3,7,10,11
IBUS11: IC16.8(D4) ; also sheet 3,7,10,11
IBUS12: IC16.13(D5) ; also sheet 3,7,10,11
IBUS13: IC16.14(D6) ; also sheet 3,7,10,11
IBUS14: IC16.17(D7) ; also sheet 3,7,10,11
IBUS15: IC16.18(D8) ; also sheet 3,7,10,11
IR0: IC12.41(2A1) IC40.2(Q1) IC42.2(A1) ; also sheet 6,7,11
IR1: IC12.40(2A2) IC40.5(Q2) IC42.3(A2) ; also sheet 6,7,11
IR2: IC12.37(2A4) IC40.6(Q3) IC42.4(A3) ; also sheet 6,7,11
IR3: IC12.36(3A1) IC40.9(Q4) IC42.5(A4) ; also sheet 6,7,11
IR4: IC12.32(3A4) IC40.12(Q5) IC42.6(A5) ; also sheet 6,7
IR5: IC12.30(4A1) IC40.15(Q6) IC42.7(A6) ; also sheet 6,7
IR6: IC12.27(4A3) IC40.16(Q7) IC42.8(A7) ; also sheet 6,7
IR7: IC12.26(4A4) IC40.19(Q8) IC42.9(A8) ; also sheet 6,7
IR8: IC16.2(Q1) IC17.2(A1) ; also sheet 6,7
IR9: IC16.5(Q2) IC17.3(A2) ; also sheet 6,7
IR10: IC16.6(Q3) IC17.4(A3) ; also sheet 7
IR11: IC16.9(Q4) IC17.5(A4) ; also sheet 4
IR12: IC16.12(Q5) IC17.6(A5) ; also sheet 4
IR13: IC16.15(Q6) IC17.7(A6) ; also sheet 4
IR14: IC16.16(Q7) IC17.8(A7) ; also sheet 4
IR15: IC16.19(Q8) IC17.9(A8) ; also sheet 4
UPC0: IC12.43(1A4) ; also sheet 4
UPC1: IC12.44(1A3) ; also sheet 4
UPC2: IC12.46(1A2) ; also sheet 4
UPC3: IC12.47(1A1) ; also sheet 4
VCC [low power]: C46.2 C47.2 C48.2 C49.2 C50.2 ; also sheet 2,3,4,5,6,7,9,10,11
Unconnected: IC12.1(1G) IC12.11(2Y3) IC12.14(3Y2) IC12.16(3Y3) IC12.20(4Y2) IC12.24(4G) IC12.25(3G) IC12.29(4A2) IC12.33(3A3) IC12.35(3A2) IC12.38(2A3) IC12.48(2G)

### Buses
IBUS[0..15]
IR[0..15]
FPIR[0..15]

### Notes on the sheet
- Instruction Register (IR) | Front Panel Buffers & Connectors
- Decoupling
- NC
- U

## Sheet 9 of 11
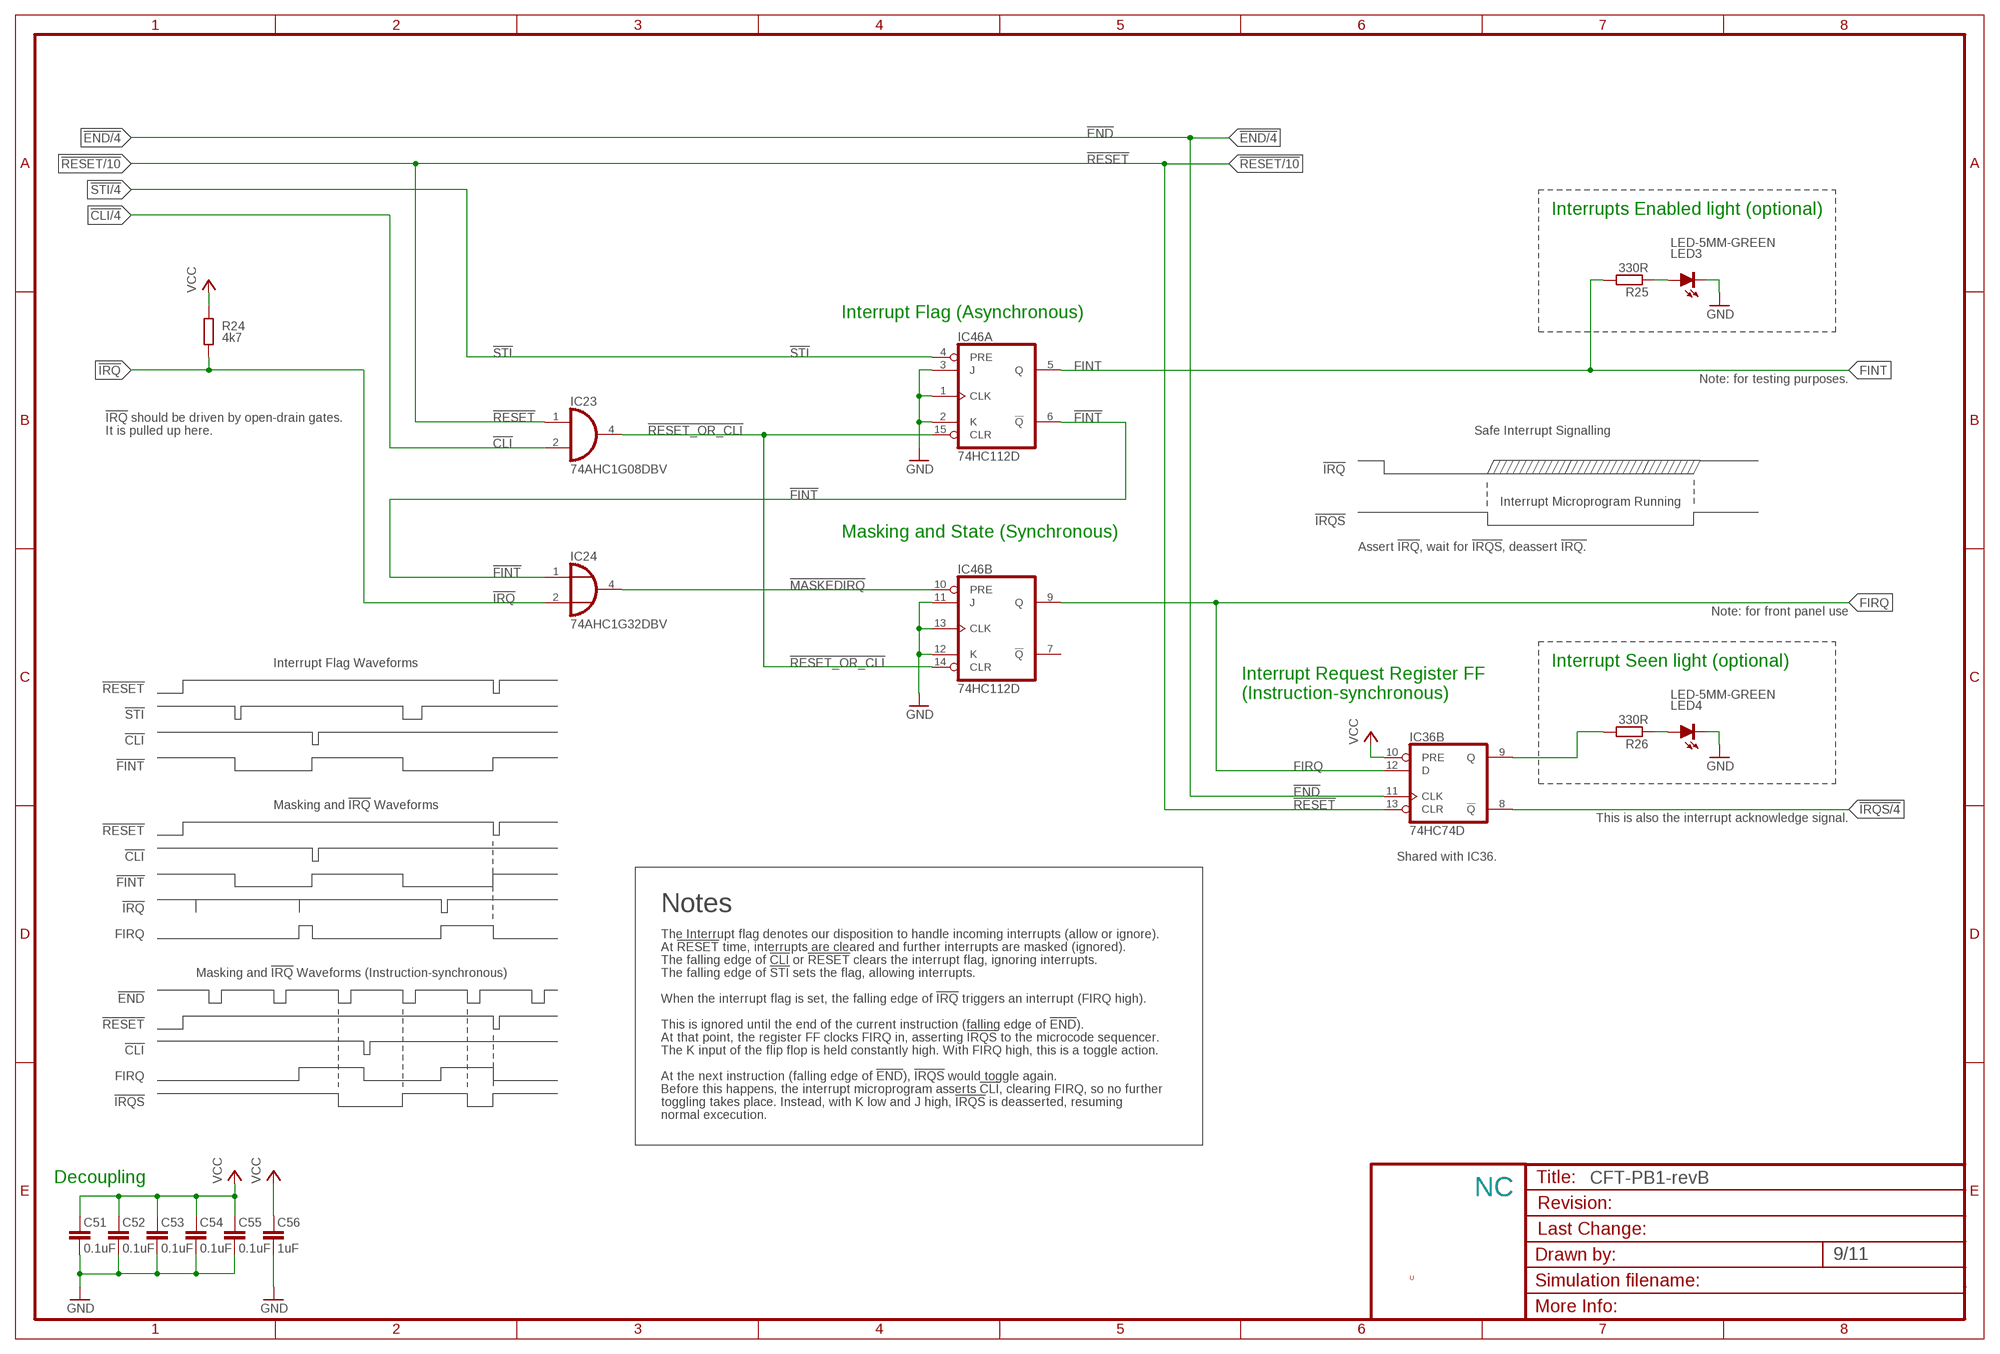
[diagram p8: schematic, sheet 9]

### Parts
C51  0.1uF  C-EUC0805K  [C0805K]
C52  0.1uF  C-EUC0805K  [C0805K]
C53  0.1uF  C-EUC0805K  [C0805K]
C54  0.1uF  C-EUC0805K  [C0805K]
C55  0.1uF  C-EUC0805K  [C0805K]
C56  1uF  C-EUC1206K  [C1206K]
IC23  74AHC1G08DBV  [SOT23-5]
IC24  74AHC1G32DBV  [SOT23-5]
IC46  74HC112D  [SO16]
LED3  LED-5MM-GREEN  LEDCHIPLED_0805  [CHIPLED_0805]
LED4  LED-5MM-GREEN  LEDCHIPLED_0805  [CHIPLED_0805]
R24  4k7  R-EU_R0805  [R0805]
R25  330R  R-EU_R0805  [R0805]
R26  330R  R-EU_R0805  [R0805]

### Nets
!CLI: IC23.2(I1) ; also sheet 4
!END: IC36.11(B:CLK) ; also sheet 4,7
!FINT: IC24.1(I0) IC46.6(A:!Q)
!IRQ: IC24.2(I1) R24.1 ; also sheet 11
!IRQS: IC36.8(B:!Q) ; also sheet 4,11
!MASKEDIRQ: IC24.4(O) IC46.10(B:PRE)
!RESET: IC23.1(I0) IC36.13(B:CLR) ; also sheet 2,3,5,6,8,10,11
!RESET_OR_CLI: IC23.4(O) IC46.14(B:CLR) IC46.15(A:CLR)
!STI: IC46.4(A:PRE) ; also sheet 4
FINT: IC46.5(A:Q) R25.2
FIRQ: IC36.12(B:D) IC46.9(B:Q) ; also sheet 4
GND [low power]: C51.1 C52.1 C53.1 C54.1 C55.1 C56.1 IC46.1(A:CLK) IC46.2(A:K) IC46.3(A:J) IC46.11(B:J) IC46.12(B:K) IC46.13(B:CLK) LED3.C LED4.C ; also sheet 2,3,4,5,6,7,8,10,11
N$732: LED4.A R26.1
N$733: LED3.A R25.1
N$739: IC36.9(B:Q) R26.2
VCC [low power]: C51.2 C52.2 C53.2 C54.2 C55.2 C56.2 IC36.10(B:PRE) R24.2 ; also sheet 2,3,4,5,6,7,8,10,11
Unconnected: IC46.7(B:!Q)

### Notes on the sheet
- Interrupts Enabled light (optional)
- Interrupt Flag (Asynchronous)
- Note: for testing purposes.
- !IRQ! should be driven by open-drain gates.
- It is pulled up here. | Safe Interrupt Signalling
- !IRQ
- Interrupt Microprogram Running
- !IRQS
- Masking and State (Synchronous)
- Assert !IRQ, wait for !IRQS, deassert !IRQ.
- Note: for front panel use
- Interrupt Flag Waveforms | Interrupt Seen light (optional)
- Interrupt Request Register FF
- !RESET
- (Instruction-synchronous)
- !STI
- !CLI
- !FINT
- Masking and !IRQ! Waveforms
- This is also the interrupt acknowledge signal.
- !RESET
- !CLI | Shared with IC36.
- !FINT
- !IRQ | Notes
- FIRQ | The Interrupt flag denotes our disposition to handle incoming interrupts (allow or ignore).
- At !RESET! time, interrupts are cleared and further interrupts are masked (ignored).
- The falling edge of !CLI! or !RESET! clears the interrupt flag, ignoring interrupts.
- Masking and !IRQ! Waveforms (Instruction-synchronous) | The falling edge of !STI! sets the flag, allowing interrupts.
- !END | When the interrupt flag is set, the falling edge of !IRQ! triggers an interrupt (FIRQ high).
- !RESET | This is ignored until the end of the current instruction (falling edge of !END!).
- At that point, the register FF clocks FIRQ in, asserting !IRQS! to the microcode sequencer.
- !CLI | The K input of the flip flop is held constantly high. With FIRQ high, this is a toggle action.
- FIRQ | At the next instruction (falling edge of !END!), !IRQS! would toggle again.
- Before this happens, the interrupt microprogram asserts !CLI!, clearing FIRQ, so no further
- !IRQS | toggling takes place. Instead, with K low and J high, !IRQS! is deasserted, resuming
- normal excecution.
- Decoupling
- NC
- U

## Sheet 10 of 11
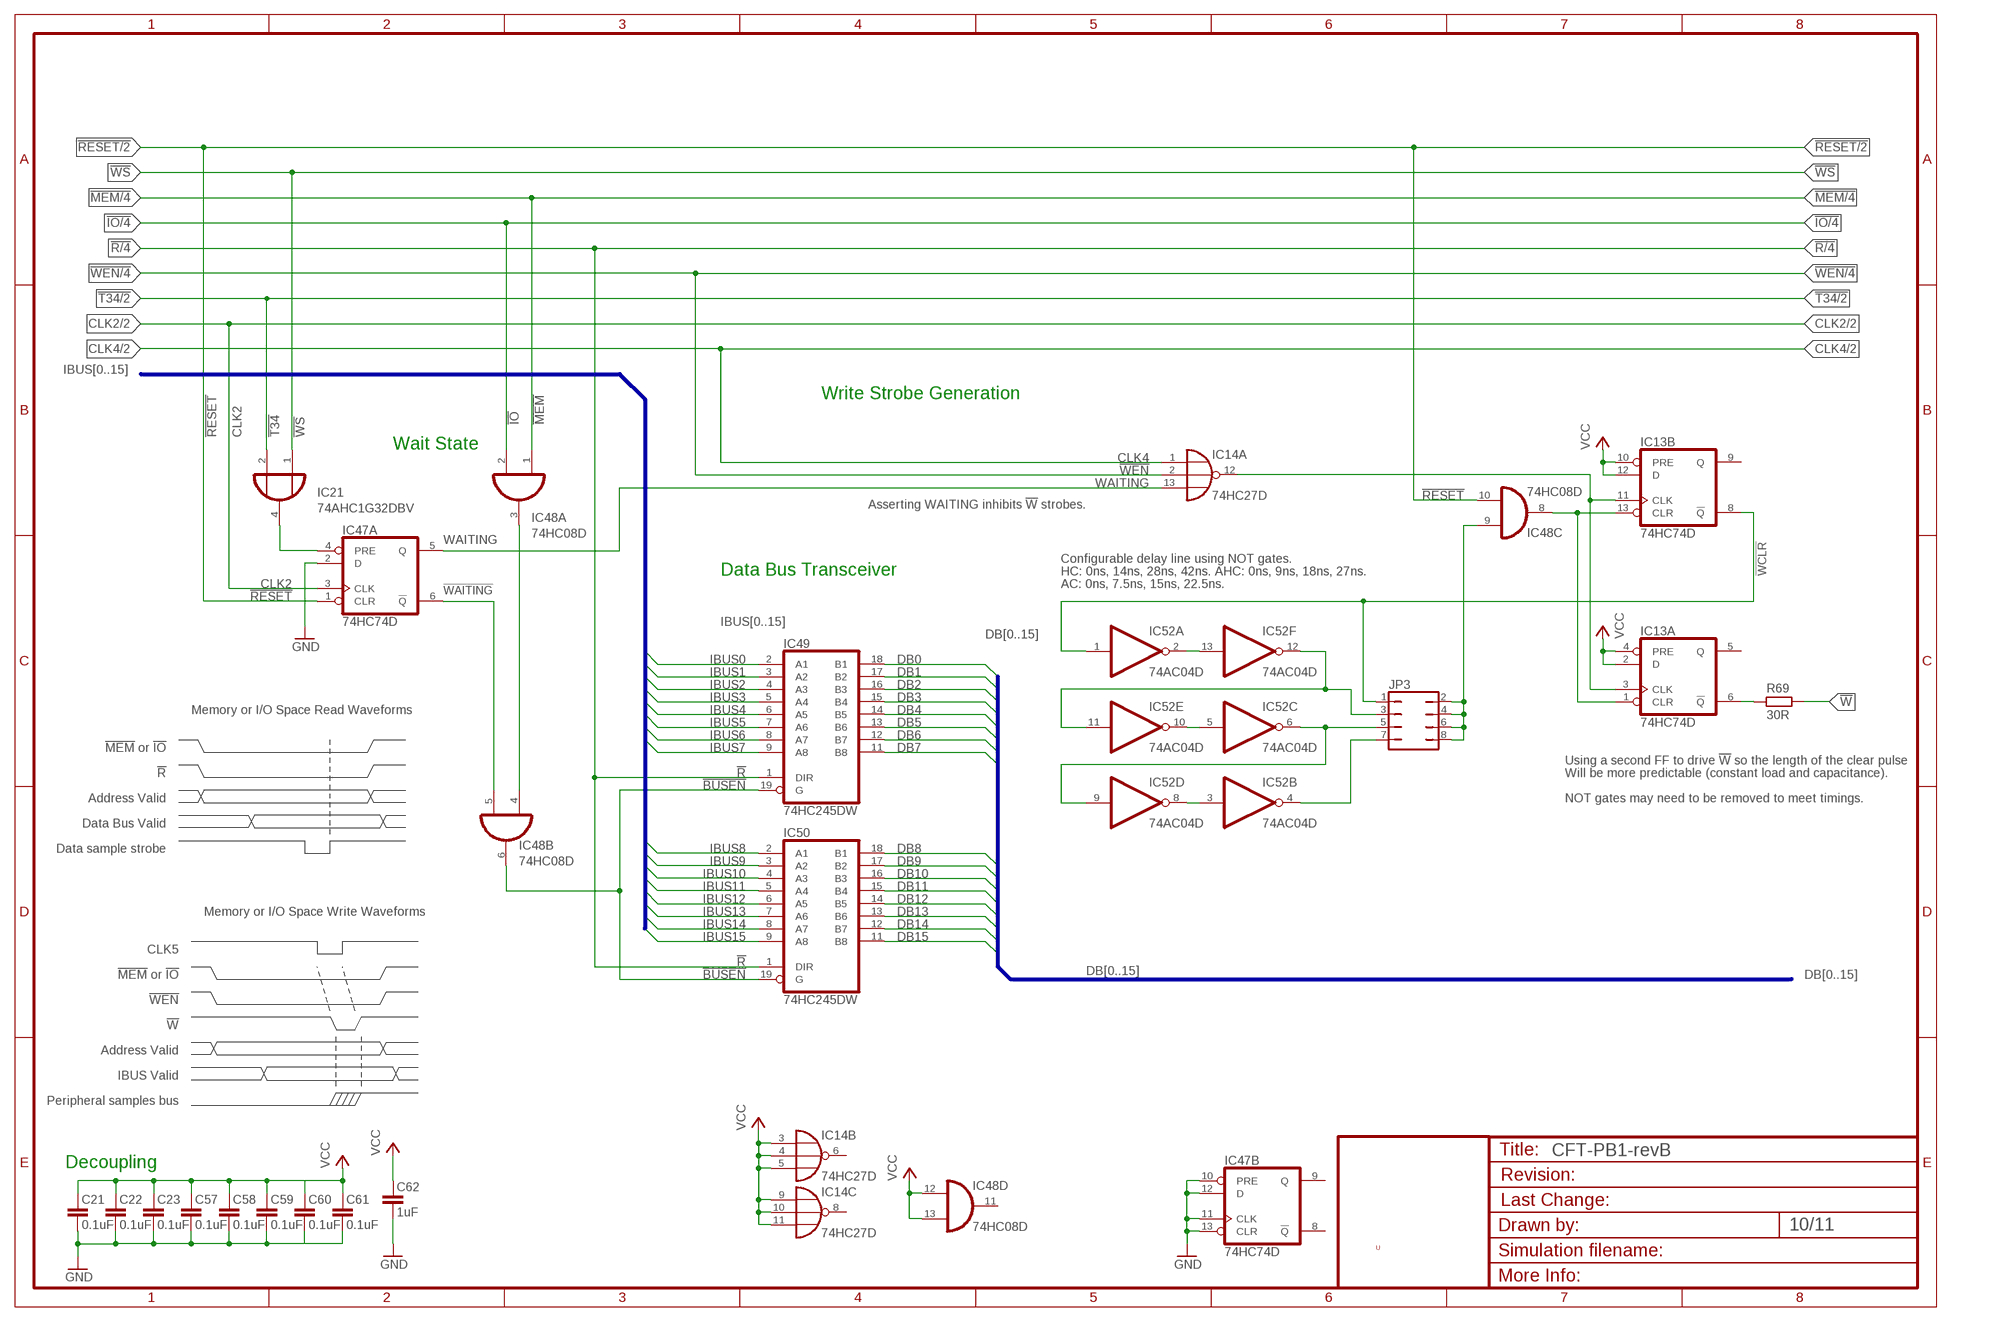
[diagram p9: schematic, sheet 10]

### Parts
C21  0.1uF  C-EUC0805K  [C0805K]
C22  0.1uF  C-EUC0805K  [C0805K]
C23  0.1uF  C-EUC0805K  [C0805K]
C57  0.1uF  C-EUC0805K  [C0805K]
C58  0.1uF  C-EUC0805K  [C0805K]
C59  0.1uF  C-EUC0805K  [C0805K]
C60  0.1uF  C-EUC0805K  [C0805K]
C61  0.1uF  C-EUC0805K  [C0805K]
C62  1uF  C-EUC1206K  [C1206K]
IC13  74HC74D  [SO14]
IC14  74HC27D  [SO14]
IC21  74AHC1G32DBV  [SOT23-5]
IC47  74HC74D  [SO14]
IC48  74HC08D  [SO14]
IC49  74HC245DW  [SO20W]
IC50  74HC245DW  [SO20W]
IC52  74AC04D  [SO14]
JP3  JP4Q  [JP4Q]
R69  30R  R-EU_R0805  [R0805]

### Nets
!BUSEN: IC48.6(B:O) IC49.19(G) IC50.19(G)
!EN0: IC48.3(A:O) IC48.4(B:I0)
!IO: IC48.2(A:I1) ; also sheet 4,11
!MEM: IC48.1(A:I0) ; also sheet 4,11
!R: IC49.1(DIR) IC50.1(DIR) ; also sheet 4,11
!RESET: IC47.1(A:CLR) IC48.10(C:I1) ; also sheet 2,3,5,6,8,9,11
!T34: IC21.2(I1) ; also sheet 2,11
!W: R69.1 ; also sheet 11
!WAITING: IC47.6(A:!Q) IC48.5(B:I1)
!WCLR: IC13.8(B:!Q) IC52.1(A:I) JP3.1
!WEN: IC14.2(A:I1) ; also sheet 4,11
!WS: IC21.1(I0) ; also sheet 11
CLK2: IC47.3(A:CLK) ; also sheet 2,11
CLK4: IC14.1(A:I0) ; also sheet 2,6,11
DB0: IC49.18(B1) ; also sheet 11
DB1: IC49.17(B2) ; also sheet 11
DB2: IC49.16(B3) ; also sheet 11
DB3: IC49.15(B4) ; also sheet 11
DB4: IC49.14(B5) ; also sheet 11
DB5: IC49.13(B6) ; also sheet 11
DB6: IC49.12(B7) ; also sheet 11
DB7: IC49.11(B8) ; also sheet 11
DB8: IC50.18(B1) ; also sheet 11
DB9: IC50.17(B2) ; also sheet 11
DB10: IC50.16(B3) ; also sheet 11
DB11: IC50.15(B4) ; also sheet 11
DB12: IC50.14(B5) ; also sheet 11
DB13: IC50.13(B6) ; also sheet 11
DB14: IC50.12(B7) ; also sheet 11
DB15: IC50.11(B8) ; also sheet 11
GND [low power]: C21.1 C22.1 C23.1 C57.1 C58.1 C59.1 C60.1 C61.1 C62.1 IC47.2(A:D) IC47.10(B:PRE) IC47.11(B:CLK) IC47.12(B:D) IC47.13(B:CLR) ; also sheet 2,3,4,5,6,7,8,9,11
IBUS0: IC49.2(A1) ; also sheet 3,7,8,11
IBUS1: IC49.3(A2) ; also sheet 3,7,8,11
IBUS2: IC49.4(A3) ; also sheet 3,7,8,11
IBUS3: IC49.5(A4) ; also sheet 3,7,8,11
IBUS4: IC49.6(A5) ; also sheet 3,7,8,11
IBUS5: IC49.7(A6) ; also sheet 3,7,8,11
IBUS6: IC49.8(A7) ; also sheet 3,7,8,11
IBUS7: IC49.9(A8) ; also sheet 3,7,8,11
IBUS8: IC50.2(A1) ; also sheet 3,7,8,11
IBUS9: IC50.3(A2) ; also sheet 3,7,8,11
IBUS10: IC50.4(A3) ; also sheet 3,7,8,11
IBUS11: IC50.5(A4) ; also sheet 3,7,8,11
IBUS12: IC50.6(A5) ; also sheet 3,7,8,11
IBUS13: IC50.7(A6) ; also sheet 3,7,8,11
IBUS14: IC50.8(A7) ; also sheet 3,7,8,11
IBUS15: IC50.9(A8) ; also sheet 3,7,8,11
N$1: IC13.3(A:CLK) IC13.11(B:CLK) IC14.12(A:O)
N$15: IC52.11(E:I) IC52.12(F:O) JP3.3
N$16: IC52.2(A:O) IC52.13(F:I)
N$17: IC52.5(C:I) IC52.10(E:O)
N$18: IC52.6(C:O) IC52.9(D:I) JP3.5
N$19: IC21.4(O) IC47.4(A:PRE)
N$20: IC52.3(B:I) IC52.8(D:O)
N$21: IC52.4(B:O) JP3.7
N$22: IC13.6(A:!Q) R69.2
N$24: IC48.9(C:I0) JP3.2 JP3.4 JP3.6 JP3.8
N$25: IC13.1(A:CLR) IC13.13(B:CLR) IC48.8(C:O)
VCC [low power]: C21.2 C22.2 C23.2 C57.2 C58.2 C59.2 C60.2 C61.2 C62.2 IC13.2(A:D) IC13.4(A:PRE) IC13.10(B:PRE) IC13.12(B:D) IC14.3(B:I0) IC14.4(B:I1) IC14.5(B:I2) IC14.9(C:I0) IC14.10(C:I1) IC14.11(C:I2) IC48.12(D:I0) IC48.13(D:I1) ; also sheet 2,3,4,5,6,7,8,9,11
WAITING: IC14.13(A:I2) IC47.5(A:Q)
Unconnected: IC13.5(A:Q) IC13.9(B:Q) IC14.6(B:O) IC14.8(C:O) IC47.8(B:!Q) IC47.9(B:Q) IC48.11(D:O)

### Buses
IBUS[0..15]
DB[0..15]

### Notes on the sheet
- Write Strobe Generation
- Wait State
- Asserting WAITING inhibits !W! strobes.
- Configurable delay line using NOT gates.
- Data Bus Transceiver | HC: 0ns, 14ns, 28ns, 42ns. AHC: 0ns, 9ns, 18ns, 27ns.
- AC: 0ns, 7.5ns, 15ns, 22.5ns.
- Memory or I/O Space Read Waveforms
- !MEM! or !IO
- Using a second FF to drive !W! so the length of the clear pulse
- !R | Will be more predictable (constant load and capacitance).
- Address Valid | NOT gates may need to be removed to meet timings.
- Data Bus Valid
- Data sample strobe
- Memory or I/O Space Write Waveforms
- CLK5
- !MEM! or !IO
- !WEN
- !W
- Address Valid
- IBUS Valid
- Peripheral samples bus
- Decoupling
- U

## Sheet 11 of 11
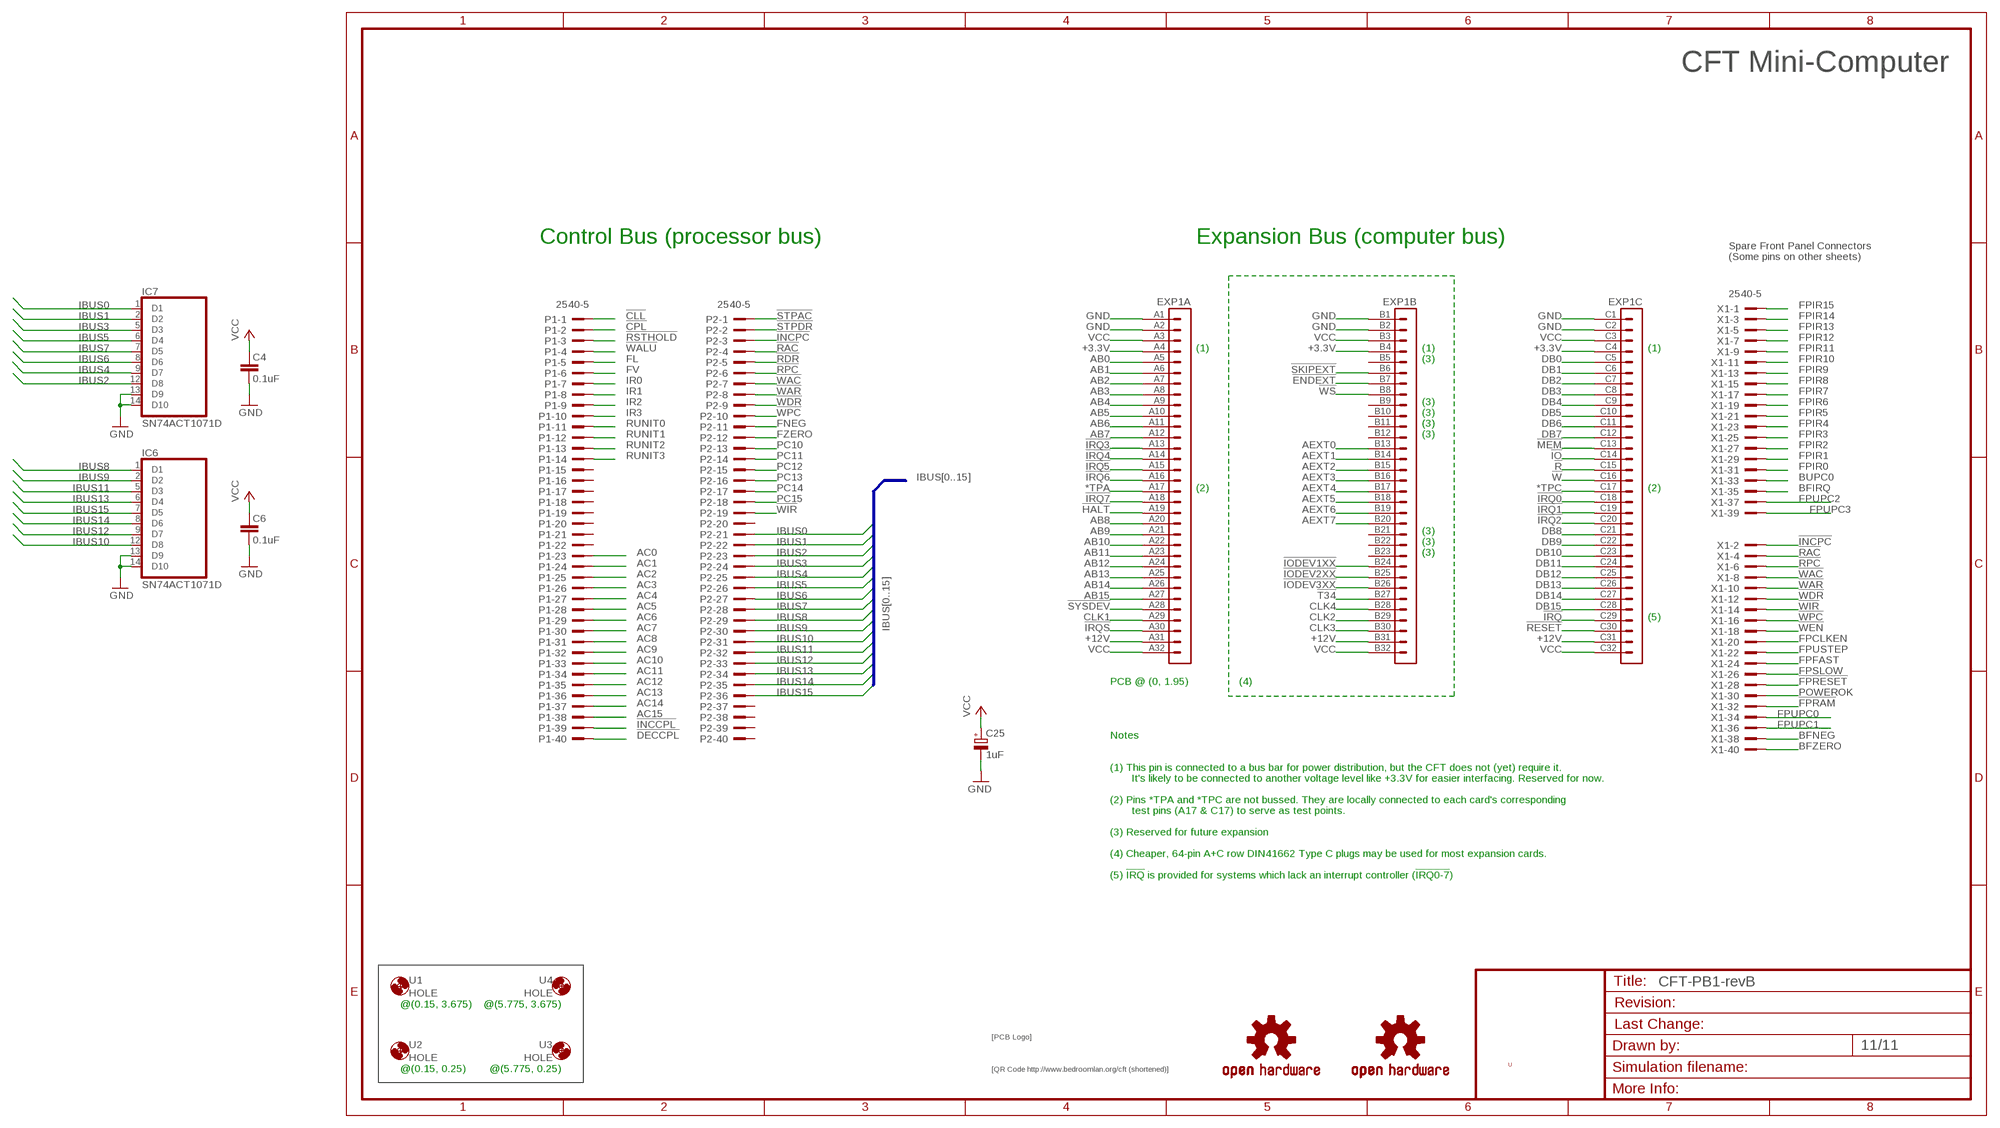
[diagram p10: schematic, sheet 11]

### Parts
$4_37_$  SIGNATURESILK  [SIGNATURE]
$4_39_$  OSHW-LOGOL  [OSHW-LOGO-L]
$4_39_$1  OSHW-LOGOL  [OSHW-LOGO-L]
$4_40_$  QRCODE-CFT  [CFT-QRCODE]
C4  0.1uF  C-EUC0805K  [C0805K]
C6  0.1uF  C-EUC0805K  [C0805K]
C25  1uF  CPOL-EUE2.5-5  [E2,5-5]
EXP1  VG96-3K  [VG96K]
IC6  SN74ACT1071D  [SO14]
IC7  SN74ACT1071D  [SO14]
P1  2540-5  [PAK100/2500-5-40]
P2  2540-5  [PAK100/2500-5-40]
U1  HOLE  [STANDOFF_28_60]
U2  HOLE  [STANDOFF_28_60]
U3  HOLE  [STANDOFF_28_60]
U4  HOLE  [STANDOFF_28_60]
X1  2540-5  [PAK100/2500-5-40]

### Nets
!CLL: P1.1 ; also sheet 4
!CPL: P1.2 ; also sheet 4
!DECCPL: P1.40
!ENDEXT: EXP1.B7
!FPRAM: X1.32
!FPRESET: X1.28 ; also sheet 3
!HALT: EXP1.A19
!INCCPL: P1.39
!INCPC: P2.3 X1.2 ; also sheet 4
!IO: EXP1.C14 ; also sheet 4,10
!IODEV1XX: EXP1.B24
!IODEV2XX: EXP1.B25
!IODEV3XX: EXP1.B26
!IRQ: EXP1.C29 ; also sheet 9
!IRQ0: EXP1.C18
!IRQ1: EXP1.C19
!IRQ2: EXP1.C20
!IRQ3: EXP1.A13
!IRQ4: EXP1.A14
!IRQ5: EXP1.A15
!IRQ6: EXP1.A16
!IRQ7: EXP1.A18
!IRQS: EXP1.A30 ; also sheet 4,9
!MEM: EXP1.C13 ; also sheet 4,10
!R: EXP1.C15 ; also sheet 4,10
!RAC: P2.4 X1.4 ; also sheet 5
!RDR: P2.5 ; also sheet 5
!RESET: EXP1.C30 ; also sheet 2,3,5,6,8,9,10
!RPC: P2.6 X1.6 ; also sheet 5
!RSTHOLD: P1.3 ; also sheet 3,4
!SKIPEXT: EXP1.B6 ; also sheet 6
!STPAC: P2.1 ; also sheet 4
!STPDR: P2.2 ; also sheet 4
!SYSDEV: EXP1.A28
!T34: EXP1.B27 ; also sheet 2,10
!W: EXP1.C16 ; also sheet 10
!WAC: P2.7 X1.8 ; also sheet 5
!WALU: P1.4 ; also sheet 5
!WAR: P2.8 X1.10 ; also sheet 5
!WDR: P2.9 X1.12 ; also sheet 5
!WEN: X1.18 ; also sheet 4,10
!WIR: P2.19 X1.14 ; also sheet 5,8
!WPC: P2.10 X1.16 ; also sheet 5
!WS: EXP1.B8 ; also sheet 10
*TPA: EXP1.A17
*TPC: EXP1.C17
+3.3V: EXP1.A4 EXP1.B4 EXP1.C4
+12V [LED power]: EXP1.A31 EXP1.B31 EXP1.C31
AB0: EXP1.A5
AB1: EXP1.A6
AB2: EXP1.A7
AB3: EXP1.A8
AB4: EXP1.A9
AB5: EXP1.A10
AB6: EXP1.A11
AB7: EXP1.A12
AB8: EXP1.A20
AB9: EXP1.A21
AB10: EXP1.A22
AB11: EXP1.A23
AB12: EXP1.A24
AB13: EXP1.A25
AB14: EXP1.A26
AB15: EXP1.A27
AC0: P1.23
AC1: P1.24
AC2: P1.25
AC3: P1.26
AC4: P1.27
AC5: P1.28
AC6: P1.29
AC7: P1.30
AC8: P1.31
AC9: P1.32
AC10: P1.33
AC11: P1.34
AC12: P1.35
AC13: P1.36
AC14: P1.37
AC15: P1.38
AEXT0: EXP1.B13
AEXT1: EXP1.B14
AEXT2: EXP1.B15
AEXT3: EXP1.B16
AEXT4: EXP1.B17
AEXT5: EXP1.B18
AEXT6: EXP1.B19
AEXT7: EXP1.B20
BFIRQ: X1.35 ; also sheet 4
BFNEG: X1.38 ; also sheet 4
BFZERO: X1.40 ; also sheet 4
BUPC0: X1.33
CLK1: EXP1.A29 ; also sheet 2,5
CLK2: EXP1.B29 ; also sheet 2,10
CLK3: EXP1.B30 ; also sheet 2,3,5
CLK4: EXP1.B28 ; also sheet 2,6,10
DB0: EXP1.C5 ; also sheet 10
DB1: EXP1.C6 ; also sheet 10
DB2: EXP1.C7 ; also sheet 10
DB3: EXP1.C8 ; also sheet 10
DB4: EXP1.C9 ; also sheet 10
DB5: EXP1.C10 ; also sheet 10
DB6: EXP1.C11 ; also sheet 10
DB7: EXP1.C12 ; also sheet 10
DB8: EXP1.C21 ; also sheet 10
DB9: EXP1.C22 ; also sheet 10
DB10: EXP1.C23 ; also sheet 10
DB11: EXP1.C24 ; also sheet 10
DB12: EXP1.C25 ; also sheet 10
DB13: EXP1.C26 ; also sheet 10
DB14: EXP1.C27 ; also sheet 10
DB15: EXP1.C28 ; also sheet 10
FL: P1.5 ; also sheet 4,6
FNEG: P2.11 ; also sheet 4,6
FPCLKEN: X1.20 ; also sheet 2
FPFAST: X1.24
FPIR0: X1.31 ; also sheet 8
FPIR1: X1.29 ; also sheet 8
FPIR2: X1.27 ; also sheet 8
FPIR3: X1.25 ; also sheet 8
FPIR4: X1.23 ; also sheet 8
FPIR5: X1.21 ; also sheet 8
FPIR6: X1.19 ; also sheet 8
FPIR7: X1.17 ; also sheet 8
FPIR8: X1.15 ; also sheet 8
FPIR9: X1.13 ; also sheet 8
FPIR10: X1.11 ; also sheet 8
FPIR11: X1.9 ; also sheet 8
FPIR12: X1.7 ; also sheet 8
FPIR13: X1.5 ; also sheet 8
FPIR14: X1.3 ; also sheet 8
FPIR15: X1.1 ; also sheet 8
FPSLOW: X1.26
FPUPC0: X1.34 ; also sheet 8
FPUPC1: X1.36 ; also sheet 8
FPUPC2: X1.37 ; also sheet 8
FPUPC3: X1.39 ; also sheet 8
FPUSTEP: X1.22 ; also sheet 2
FV: P1.6 ; also sheet 4,6
FZERO: P2.12 ; also sheet 4,6
GND [low power]: C4.1 C6.1 C25.- EXP1.A1 EXP1.A2 EXP1.B1 EXP1.B2 EXP1.C1 EXP1.C2 IC6.13(D9) IC6.14(D10) IC7.13(D9) IC7.14(D10) ; also sheet 2,3,4,5,6,7,8,9,10
IBUS0: IC7.1(D1) P2.21 ; also sheet 3,7,8,10
IBUS1: IC7.2(D2) P2.22 ; also sheet 3,7,8,10
IBUS2: IC7.12(D8) P2.23 ; also sheet 3,7,8,10
IBUS3: IC7.5(D3) P2.24 ; also sheet 3,7,8,10
IBUS4: IC7.9(D7) P2.25 ; also sheet 3,7,8,10
IBUS5: IC7.6(D4) P2.26 ; also sheet 3,7,8,10
IBUS6: IC7.8(D6) P2.27 ; also sheet 3,7,8,10
IBUS7: IC7.7(D5) P2.28 ; also sheet 3,7,8,10
IBUS8: IC6.1(D1) P2.29 ; also sheet 3,7,8,10
IBUS9: IC6.2(D2) P2.30 ; also sheet 3,7,8,10
IBUS10: IC6.12(D8) P2.31 ; also sheet 3,7,8,10
IBUS11: IC6.5(D3) P2.32 ; also sheet 3,7,8,10
IBUS12: IC6.9(D7) P2.33 ; also sheet 3,7,8,10
IBUS13: IC6.6(D4) P2.34 ; also sheet 3,7,8,10
IBUS14: IC6.8(D6) P2.35 ; also sheet 3,7,8,10
IBUS15: IC6.7(D5) P2.36 ; also sheet 3,7,8,10
IR0: P1.7 ; also sheet 6,7,8
IR1: P1.8 ; also sheet 6,7,8
IR2: P1.9 ; also sheet 6,7,8
IR3: P1.10 ; also sheet 6,7,8
PC10: P2.13 ; also sheet 7
PC11: P2.14 ; also sheet 7
PC12: P2.15 ; also sheet 7
PC13: P2.16 ; also sheet 7
PC14: P2.17 ; also sheet 7
PC15: P2.18 ; also sheet 7
POWEROK: X1.30 ; also sheet 3
RUNIT0: P1.11 ; also sheet 4,5
RUNIT1: P1.12 ; also sheet 4,5
RUNIT2: P1.13 ; also sheet 4,5
RUNIT3: P1.14 ; also sheet 4,5
VCC [low power]: C4.2 C6.2 C25.+ EXP1.A3 EXP1.A32 EXP1.B3 EXP1.B32 EXP1.C3 EXP1.C32 ; also sheet 2,3,4,5,6,7,8,9,10
Unconnected: EXP1.B5 EXP1.B9 EXP1.B10 EXP1.B11 EXP1.B12 EXP1.B21 EXP1.B22 EXP1.B23 P1.15 P1.16 P1.17 P1.18 P1.19 P1.20 P1.21 P1.22 P2.20 P2.37 P2.38 P2.39 P2.40

### Buses
IBUS[0..15]

### Notes on the sheet
- CFT Mini-Computer
- Control Bus (processor bus) | Expansion Bus (computer bus)
- Spare Front Panel Connectors
- (Some pins on other sheets)
- (1) | (1) | (1)
- (3)
- (3)
- (3)
- (3)
- (3)
- (2) | (2)
- (3)
- (3)
- (3)
- (5)
- PCB @ (0, 1.95) | (4)
- Notes
- (1) This pin is connected to a bus bar for power distribution, but the CFT does not (yet) require it.
- It's likely to be connected to another voltage level like +3.3V for easier interfacing. Reserved for now.
- (2) Pins *TPA and *TPC are not bussed. They are locally connected to each card's corresponding
- test pins (A17 & C17) to serve as test points.
- (3) Reserved for future expansion
- (4) Cheaper, 64-pin A+C row DIN41662 Type C plugs may be used for most expansion cards.
- (5) !IRQ! is provided for systems which lack an interrupt controller (!IRQ0-7!)
- @(0.15, 3.675) | @(5.775, 3.675)
- U
- @(0.15, 0.25) | @(5.775, 0.25)

## Power pins joined to a net without a drawn wire
GND: IC1.3(GND) IC2.3(GND) IC3.8(GND) IC4.8(GND) IC5.8(P:GND) IC6.3(GND) IC6.4(GND) IC7.3(GND) IC7.4(GND) IC8.8(GND) IC9.10(GND) IC10.10(GND) IC12.4(GND) IC12.10(GND) IC12.15(GND) IC12.21(GND) IC12.28(GND) IC12.34(GND) IC12.39(GND) IC12.45(GND) IC13.7(P:GND) IC14.7(P:GND) IC15.3(GND) IC16.10(GND) IC17.10(GND) IC18.10(GND) IC19.10(GND) IC20.3(GND) IC21.3(GND) IC22.3(GND) IC23.3(GND) IC24.3(GND) IC25.8(GND) IC26.8(GND) IC27.10(GND) IC28.10(GND) IC29.7(P:GND) IC30.7(P:GND) IC31.3(GND) IC32.7(P:GND) IC33.3(GND) IC34.8(GND) IC35.8(GND) IC36.7(P:GND) IC37.10(GND) IC40.10(GND) IC42.10(GND) IC43.2(GND) IC46.8(P:GND) IC47.7(P:GND) IC48.7(P:GND) IC49.10(GND) IC50.10(GND) IC52.7(P:GND)
VCC: IC1.5(VCC) IC2.5(VCC) IC3.16(VCC) IC4.16(VCC) IC5.16(P:VCC) IC6.10(VCC) IC6.11(VCC) IC7.10(VCC) IC7.11(VCC) IC8.16(VCC) IC9.20(VCC) IC10.20(VCC) IC12.7(VCC) IC12.18(VCC) IC12.31(VCC) IC12.42(VCC) IC13.14(P:VCC) IC14.14(P:VCC) IC15.5(VCC) IC16.20(VCC) IC17.20(VCC) IC18.20(VCC) IC19.20(VCC) IC20.5(VCC) IC21.5(VCC) IC22.5(VCC) IC23.5(VCC) IC24.5(VCC) IC25.16(VCC) IC26.16(VCC) IC27.20(VCC) IC28.20(VCC) IC29.14(P:VCC) IC30.14(P:VCC) IC31.5(VCC) IC32.14(P:VCC) IC33.5(VCC) IC34.16(VCC) IC35.16(VCC) IC36.14(P:VCC) IC37.20(VCC) IC40.20(VCC) IC42.20(VCC) IC43.5(VCC) IC46.16(P:VCC) IC47.14(P:VCC) IC48.14(P:VCC) IC49.20(VCC) IC50.20(VCC) IC52.14(P:VCC)

## Library data of the parts
$4_37_$ = alexios:SIGNATURE: Soup signature
$4_39_$ $4_39_$1 = SparkFun:OSHW-LOGO: Open Source Hardware Logo This logo indicates the piece of hardware it is found on incorporates a OSHW license and/or adheres to the definition of open source hardware found here: http://freedomdefined.org/OSHW
$4_40_$ = alexios:QRCODE-*: Various QR codes in silkscreen.
C1-C7 C11-C24 C27-C39 C41-C62 = rcl:C-EU: CAPACITOR, European symbol
C25 = rcl:CPOL-EU: POLARIZED CAPACITOR, European symbol
CON3 P1 P2 X1 = con-3m:2540-: 3M (TM) Pak 100 4-Wall Header Source: 3M; OC_FARNELL: 9838414; OC_NEWARK: unknown
D1-D3 = alexios:DIODE-: DIODE
EXP1 = alexios-19inch:VG96-3: PCB EUROCARD, 96-pin type C/ABC, 2.54 mm
IC1 = alexios:74*1G14: Single Schmitt-Trigger Inverter Gate
IC2 IC15 = alexios:74*1G04: INVERTER Gate
IC3 = alexios:74*253: Dual 4-to 1 line data SELECTOR/MULTIPLEXER, 3-state
IC4 = alexios:74*193: Presettable Synchronous Binary Up/Down Counter Up/down 4-bit binary counter with load and clear inputs, and borrow and carry outputs. Farnell description: <http://uk.farnell.com/nxp/74hct193n/ic-74hct-cmos-74hct193-dip16-5v/dp/382218> Order Code: 382218 Manufacturer Part No: 74HCT193N RoHS : Yes Description: IC, 74HCT CMOS, 74HCT193, DIP16, 5V Counter Type:Binary Clock Frequency:47MHz Count Maximum:15 Supply Voltage Range:4.5V to 5.5V Logic Case Style:DIP No. of Pins:16 Operating Temperature Range:-40°C to +125°C Base Number:74 Clock Frequency Max:43MHz Count Max:16 Counter Measuring Functions:Presettable Synchronous Binary Up / Down Counter Device Marking:74HCT193 IC Generic Number:74HCT193 Logic Function Number:193 Logic IC Base Number:74193 Logic IC Family:HCT Logic IC Function:Presettable Synchronous 4bit Binary Up/Down Counter No. of Gates:1 No. of Inputs:4 Operating Temperature Max:125°C Operating Temperature Min:-40°C Package / Case:DIP Supply Voltage:5V Supply Voltage Max:5.5V Supply Voltage Min:4.5V Termination Type:Through Hole
IC5 = alexios:74*139: Dual 2-line to 4-line DECODER/DEMULTIPLEXER
IC6 IC7 = alexios:SN74ACT1071: 10-BIT BUS-TERMINATION ARRAY WITH BUS-HOLD FUNCTION Datasheet: http://www.ti.com/lit/ds/scas192/scas192.pdf
IC8 = alexios:74*590: 8-bit binary COUNTER, output register
IC9 IC10 IC17-IC19 IC27 IC28 IC42 = alexios:74*541: Octal BUFFER and LINE DRIVER, 3-state
IC12 = alexios:74*16244: 16-bit BUFFER/LINE DRIVER, 3-state Datasheet <http://www.ti.com/lit/ds/scds168/scds168.pdf>
IC13 IC36 IC47 = alexios:74*74: Dual D type positive edge triggered FLIP FLOP, preset and clear
IC14 = 74xx-eu:74*27: Triple 3-input NOR gate
IC16 IC40 = alexios:74*273: Octal D type FLIP FLOP, clear
IC20 IC22 IC33 = 74xx-little-us:74*1G125: Single Bus Buffer Gate with 3-State Output
IC21 IC24 = alexios:74*1G32: 2-input OR gate
IC23 = alexios:74*1G08: 2-input AND gate
IC25 IC26 = alexios:74*138: 3-line to 8-line DECODER/DEMULTIPLEXER
IC29 IC32 = alexios:74*32: Quad 2-input OR gate
IC30 IC48 = alexios:74*08: Quad 2-input AND gate
IC31 = alexios:74*1G86: 2-input EXCLUSIV-OR gate
IC34 IC35 = alexios:74*251: 1 of 8 data SELECTOR/MULTIPLEXER, 3-state
IC37 = alexios:74*374: Octal D type transparent LATCH, edge triggered
IC43 = alexios:74*1G11: Single 3-input AND gate Datasheet <http://www.ti.com/lit/ds/symlink/sn74lvc1g11.pdf>.
IC46 = alexios:74*112: Dual J-K negative edge triggered FLIP FLOP, preset and clear
IC49 IC50 = alexios:74*245: Octal BUS TRANSCEIVER, 3-state
IC52 = alexios:74*04: Hex INVERTER
JP1 = pinhead:PINHD-1X2: PIN HEADER
JP2 = jumper:JP5Q: JUMPER
JP3 = jumper:JP4Q: JUMPER
JP4 = pinhead:PINHD-1X6: PIN HEADER
LED1-LED4 = alexios:LED: LED OSRAM: - CHIPLED LG R971, LG N971, LY N971, LG Q971, LY Q971, LO R971, LY R971 LH N974, LH R974 LS Q976, LO Q976, LY Q976 LO Q996 - Hyper CHIPLED LW Q18S LB Q993, LB Q99A, LB R99A - SideLED LS A670, LO A670, LY A670, LG A670, LP A670 LB A673, LV A673, LT A673, LW A673 LH A674 LY A675 LS A676, LA A676, LO A676, LY A676, LW A676 LS A679, LY A679, LG A679 - Hyper Micro SIDELED® LS Y876, LA Y876, LO Y876, LY Y876 LT Y87S - SmartLED LW L88C, LW L88S LB L89C, LB L89S, LG L890 LS L89K, LO L89K, LY L89K LS L896, LA L896, LO L896, LY L896 - TOPLED LS T670, LO T670, LY T670, LG T670, LP T670 LSG T670, LSP T670, LSY T670, LOP T670, LYG T670 LG T671, LOG T671, LSG T671 LB T673, LV T673, LT T673, LW T673 LH T674 LS T676, LA T676, LO T676, LY T676, LB T676, LH T676, LSB T676, LW T676 LB T67C, LV T67C, LT T67C, LS T67K, LO T67K, LY T67K, LW E67C LS E67B, LA E67B, LO E67B, LY E67B, LB E67C, LV E67C, LT E67C LW T67C LS T679, LY T679, LG T679 LS T770, LO T770, LY T770, LG T770, LP T770 LB T773, LV T773, LT T773, LW T773 LH T774 LS E675, LA E675, LY E675, LS T675 LS T776, LA T776, LO T776, LY T776, LB T776 LHGB T686 LT T68C, LB T68C - Hyper Mini TOPLED® LB M676 - Mini TOPLED Santana® LG M470 LS M47K, LO M47K, LY M47K Source: http://www.osram.convergy.de LUXEON: - LUMILED® LXK2-PW12-R00, LXK2-PW12-S00, LXK2-PW14-U00, LXK2-PW14-V00 LXK2-PM12-R00, LXK2-PM12-S00, LXK2-PM14-U00 LXK2-PE12-Q00, LXK2-PE12-R00, LXK2-PE12-S00, LXK2-PE14-T00, LXK2-PE14-U00 LXK2-PB12-K00, LXK2-PB12-L00, LXK2-PB12-M00, LXK2-PB14-N00, LXK2-PB14-P00, LXK2-PB14-Q00 LXK2-PR12-L00, LXK2-PR12-M00, LXK2-PR14-Q00, LXK2-PR14-R00 LXK2-PD12-Q00, LXK2-PD12-R00, LXK2-PD12-S00 LXK2-PH12-R00, LXK2-PH12-S00 LXK2-PL12-P00, LXK2-PL12-Q00, LXK2-PL12-R00 Source: www.luxeon.com KINGBRIGHT: KA-3528ASYC Source: www.kingbright.com
R1-R16 R18-R20 R22-R26 R30 R54-R59 R62-R67 R69 = resistor:R-EU_: RESISTOR, European symbol
R21 = rcl:R-EU_: RESISTOR, European symbol
RN1 RN2 = resistor-sil:G08R: SIL RESISTOR; OC_FARNELL: unknown; OC_NEWARK: unknown
RN3 = resistor-sil:G04R: SIL RESISTOR; OC_FARNELL: unknown; OC_NEWARK: unknown
S1 = SparkFun:TAC_SWITCH: Momentary Switch Button commonly used for reset or general input. Spark Fun Electronics SKU : COM-00097
U1-U4 = alexios:HOLE: Hole for a standoff or mount. Hole diameter: 3.3mm. External Diameter: 6mm. Suitable for M3 standoffs.
XTAL1 XTAL2 = alexios:XO-: Crystal Oscillator for DIP sockets Crystal oscillators in DIP8 or DIP14 packages with sockets. Drills extra holes on the PCB to allow a standard DIP8 or DIP14 socket to be installed.

## Net classes
0 default: width 0.152 mm, clearance 0.152 mm
1 low power: width 0.305 mm, clearance 0.152 mm
2 LED power: width 0.406 mm, clearance 0.254 mm